# EasyEDA Pro project EasyedaPrj_POCKET_DICE_2026-03-14.epro, board PCB1
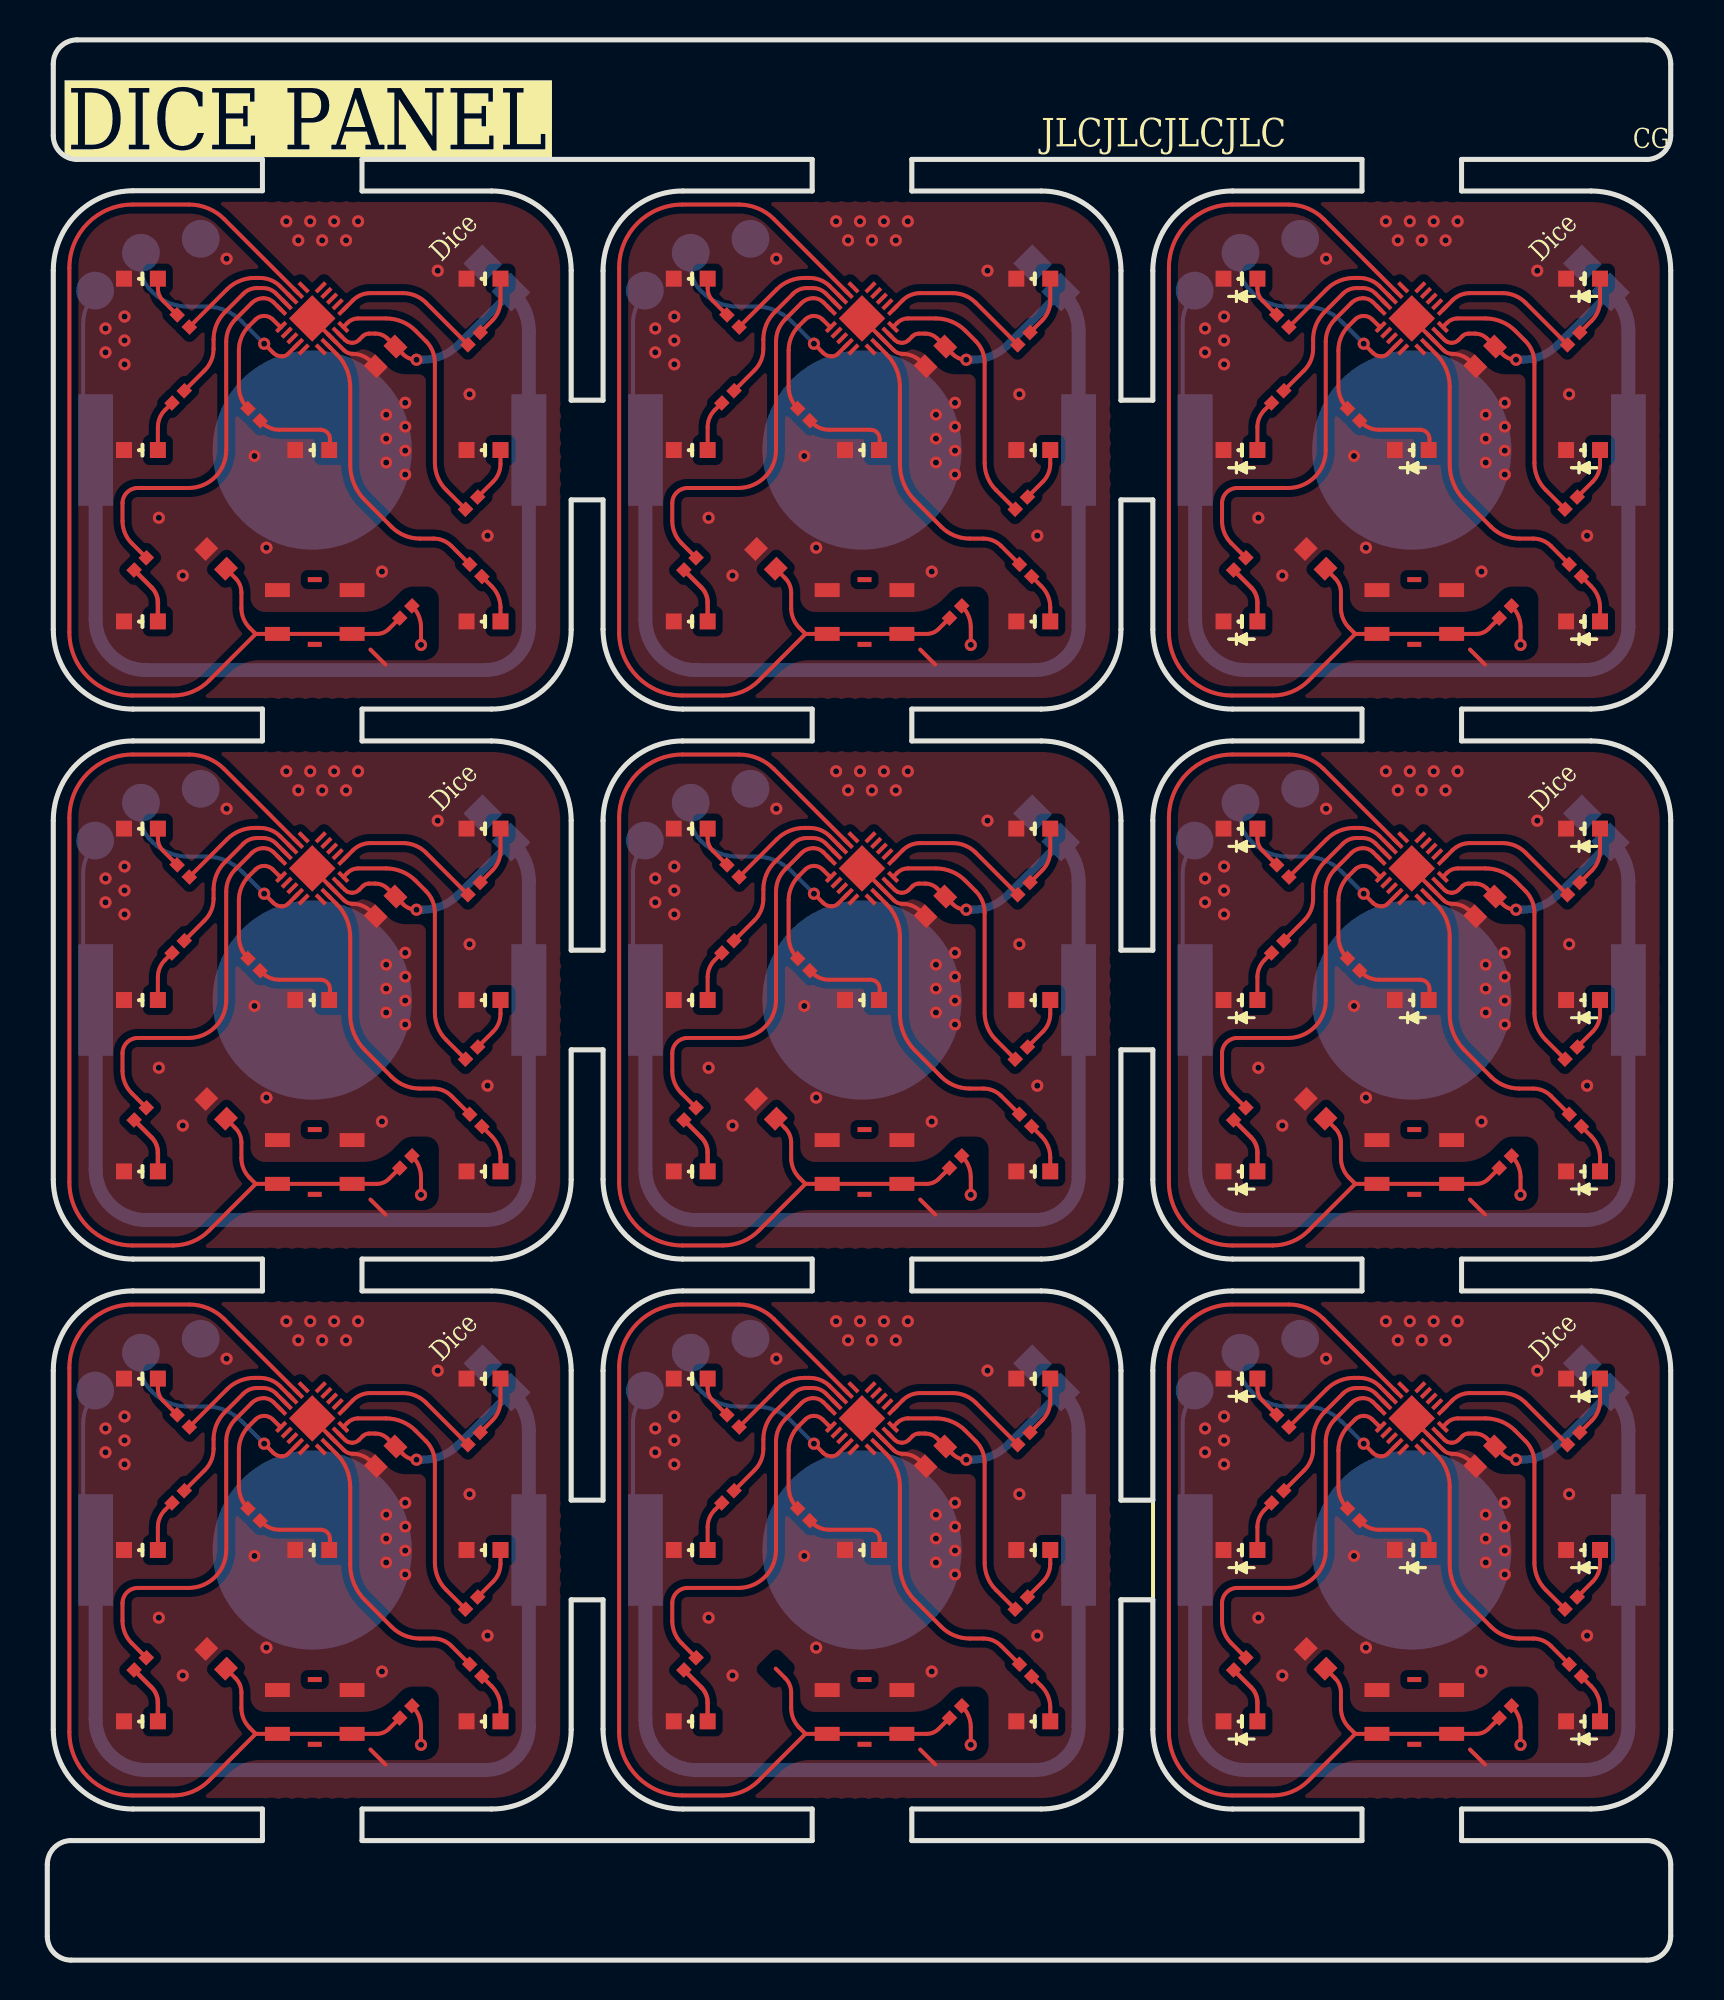
[diagram p1: board, top side]
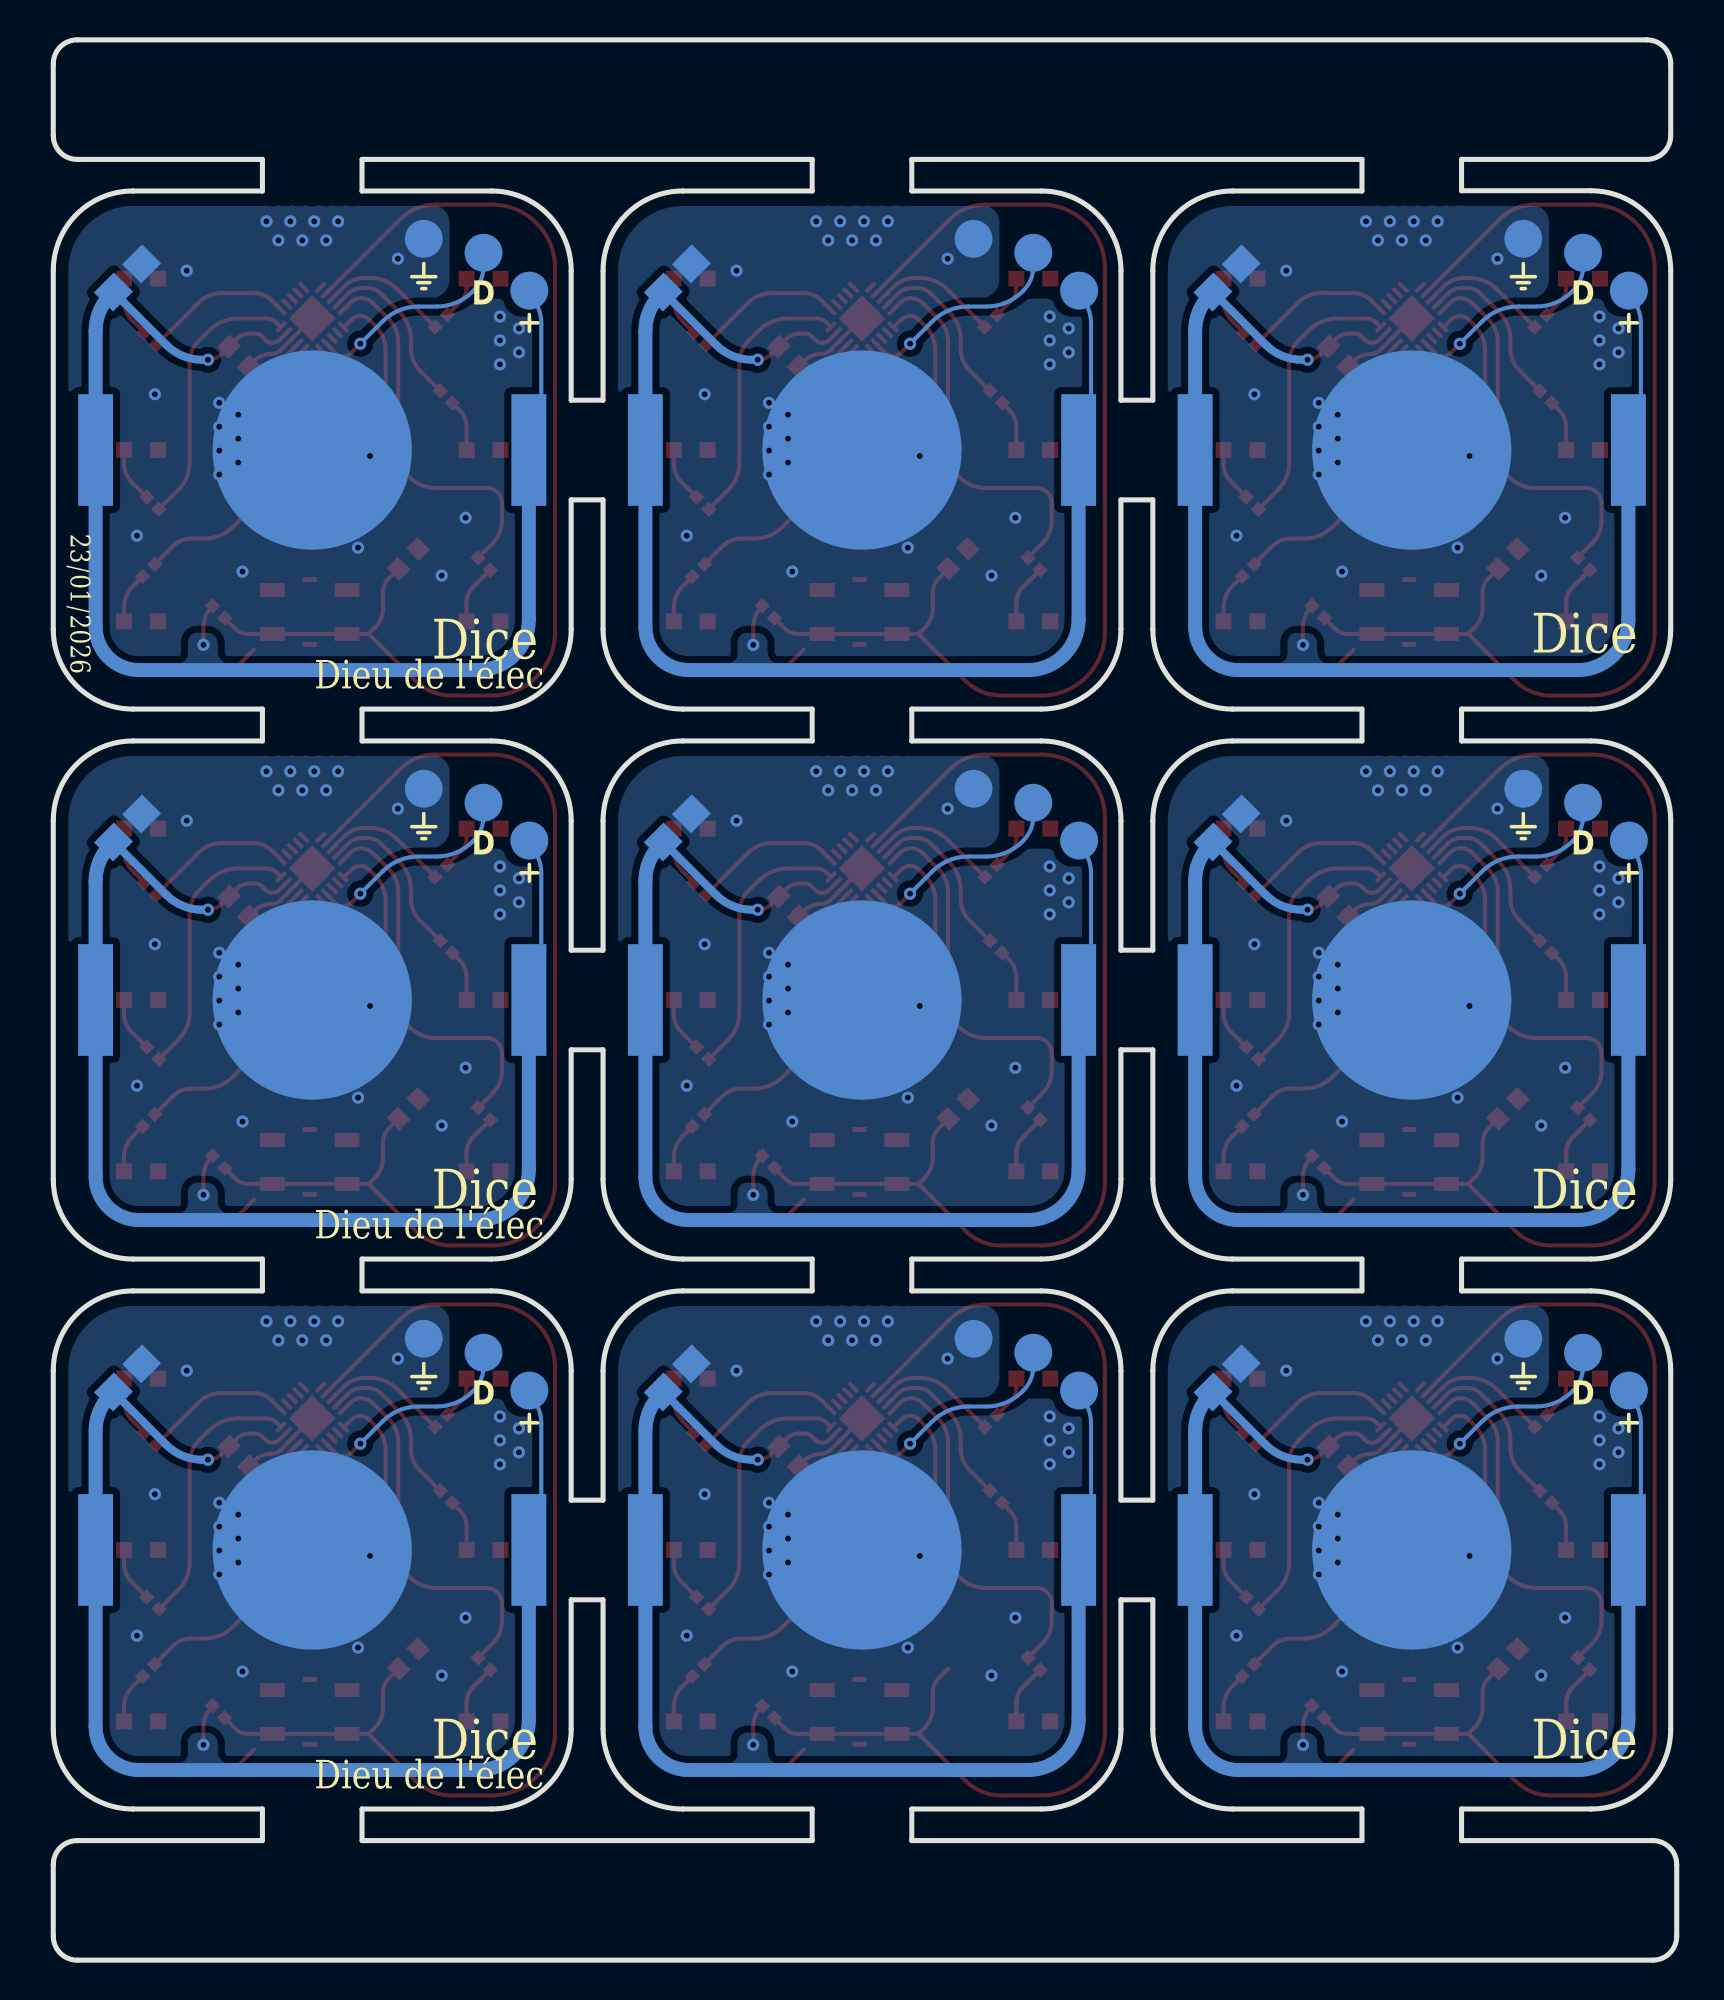
[diagram p2: board, bottom side, seen from below]

Outline 81.5 x 96.37 mm; copper layers: Top Layer, Bottom Layer. Coordinates in mm from the lower left corner of the outline.
Outline path: 0,4.8 0,1.2 arc(0.35,0.35) 1.2,0 80.3,0 arc(81.15,0.35) 81.5,1.2 81.5,4.8 arc(81.15,5.65) 80.3,6 71,6 71,7.58 77.5,7.58 arc(80.33,8.76) 81.5,11.58 81.5,29.58 arc(80.33,32.41) 77.5,33.58 71,33.58 71,35.18 77.5,35.18 arc(80.33,36.36) 81.5,39.18 81.5,57.18 arc(80.33,60.01) 77.5,61.18 71,61.18 71,62.78 77.5,62.78 arc(80.33,63.96) 81.5,66.78 81.5,84.78 arc(80.33,87.61) 77.5,88.78 71,88.78 71,90.37 80.3,90.37 arc(81.15,90.72) 81.5,91.57 81.5,95.17 arc(81.15,96.02) 80.3,96.37 1.5,96.37 arc(0.65,96.02) 0.3,95.17 0.3,91.57 arc(0.65,90.72) 1.5,90.37 10.8,90.37 10.8,88.8 4.31,88.8 arc(1.47,87.62) 0.3,84.78 0.3,66.78 arc(1.47,63.96) 4.3,62.78 10.8,62.78 10.8,61.2 arc(10.8,61.19) 10.79,61.18 4.3,61.18 arc(1.47,60.01) 0.3,57.18 0.3,39.18 arc(1.47,36.36) 4.3,35.18 10.8,35.18 10.8,33.58 4.3,33.58 arc(1.47,32.41) 0.3,29.58 0.3,11.58 arc(1.47,8.76) 4.3,7.58 10.8,7.58 10.8,6 1.2,6 arc(0.35,5.65) 0,4.8 ; 15.8,90.37 38.4,90.37 38.4,88.78 31.9,88.78 arc(29.07,87.61) 27.9,84.78 27.9,78.28 26.3,78.28 26.3,84.78 arc(25.13,87.61) 22.3,88.78 15.8,88.78 15.8,90.37 ; 15.8,62.78 15.8,61.18 22.3,61.18 arc(25.13,60.01) 26.3,57.18 26.3,50.68 27.9,50.68 27.9,57.18 arc(29.07,60.01) 31.9,61.18 38.4,61.18 38.4,62.78 31.9,62.78 arc(29.07,63.96) 27.9,66.78 27.9,73.28 26.3,73.28 26.3,66.78 arc(25.13,63.96) 22.3,62.78 15.8,62.78 ; 15.8,35.18 15.8,33.58 22.3,33.58 arc(25.13,32.41) 26.3,29.58 26.3,23.08 27.9,23.08 27.9,29.58 arc(29.07,32.41) 31.9,33.58 38.4,33.58 38.4,35.18 31.9,35.18 arc(29.07,36.36) 27.9,39.18 27.9,45.68 26.3,45.68 26.3,39.18 arc(25.13,36.36) 22.3,35.18 15.8,35.18 ; 15.8,7.58 22.3,7.58 arc(25.13,8.76) 26.3,11.58 26.3,18.08 27.9,18.08 27.9,11.58 arc(29.07,8.76) 31.9,7.58 38.4,7.58 38.4,6 15.8,6 15.8,7.58 ; 43.4,90.37 66,90.37 66,88.78 59.5,88.78 arc(56.67,87.61) 55.5,84.78 55.5,78.28 53.9,78.28 53.9,84.78 arc(52.73,87.61) 49.9,88.78 43.4,88.78 43.4,90.37 ; 43.4,62.78 43.4,61.18 49.9,61.18 arc(52.73,60.01) 53.9,57.18 53.9,50.68 55.5,50.68 55.5,57.18 arc(56.67,60.01) 59.5,61.18 66,61.18 66,62.78 59.5,62.78 arc(56.67,63.96) 55.5,66.78 55.5,73.28 53.9,73.28 53.9,66.78 arc(52.73,63.96) 49.9,62.78 43.4,62.78 ; 43.4,35.18 43.4,33.58 49.9,33.58 arc(52.73,32.41) 53.9,29.58 53.9,23.08 55.5,23.08 55.5,29.58 arc(56.67,32.41) 59.5,33.58 66,33.58 66,35.18 59.5,35.18 arc(56.67,36.36) 55.5,39.18 55.5,45.68 53.9,45.68 53.9,39.18 arc(52.73,36.36) 49.9,35.18 43.4,35.18 ; 43.4,7.58 49.9,7.58 arc(52.73,8.76) 53.9,11.58 53.9,18.08 55.5,18.08 55.5,11.58 arc(56.67,8.76) 59.5,7.58 66,7.58 66,6 43.4,6 43.4,7.58
Stack: Top Layer 0.035mm / Dielectric1 1.51mm FR4 er 4.5 / Bottom Layer 0.035mm

## Design rules (mm)
template: Custom Config
spacing copperThickness1oz (default): track to track 0.102, other pairs 0.152 to 0.3
spacing copperThickness2oz: track to track 0.203, other pairs 0.152 to 0.3
track width copperThickness1oz (default): min 0.127, default 0.254, max 2.54
track width copperThickness2oz: min 0.203, default 0.254, max 2.54
differential pair differentialPair (default): width min 0.127, default 0.254, max 2.54; gap min 0.152, default 0.152
via viaSize (default): diameter min 0.5, default 0.61, max 10; hole min 0.3, default 0.305, max 6.3
net GND.A uses Dice back
pour e985 uses Dice

## Placement (name value [footprint] x y rotation side)
C1  100nF  [C0603]  16.98 80.48 225 top
C1#2  -  [C0603]  44.58 80.48 225 top
C1#3  -  [C0603]  72.18 80.48 225 top
C1#4  -  [C0603]  16.98 52.88 225 top
C1#5  -  [C0603]  44.58 52.88 225 top
C1#6  -  [C0603]  72.18 52.88 225 top
C1#7  -  [C0603]  16.98 25.28 225 top
C1#8  -  [C0603]  44.58 25.28 225 top
C1#9  -  [C0603]  72.18 25.28 225 top
C2  10µF  [C0805]  22.57 84.42 135 bottom
C2#2  -  [C0805]  50.17 84.42 135 bottom
C2#3  -  [C0805]  77.77 84.42 135 bottom
C2#4  -  [C0805]  22.57 56.82 135 bottom
C2#5  -  [C0805]  50.17 56.82 135 bottom
C2#6  -  [C0805]  77.77 56.82 135 bottom
C2#7  -  [C0805]  22.57 29.22 135 bottom
C2#8  -  [C0805]  50.17 29.22 135 bottom
C2#9  -  [C0805]  77.77 29.22 135 bottom
C3  100nF  [C0603]  36.07 70.32 135 top
C3#2  -  [C0603]  63.67 70.32 135 top
C3#3  -  [C0603]  8.47 42.72 135 top
C3#4  -  [C0603]  36.07 42.72 135 top
C3#5  -  [C0603]  63.67 42.72 135 top
C3#6  -  [C0603]  8.47 15.12 135 top
C3#7  -  [C0603]  63.67 15.12 135 top
C3#8  -  [C0603]  8.47 70.32 135 top
LED1  XL-1608UOC-06  [ESPIO 0603 LED clean]  77.1 67.18 0 top
LED1#2  -  [ESPIO 0603 LED clean]  77.1 39.58 0 top
LED1#3  -  [ESPIO 0603 LED clean]  77.1 11.98 0 top
LED2  XL-1608UOC-06  [ESPIO 0603 LED clean]  77.1 75.78 0 top
LED2#2  -  [ESPIO 0603 LED clean]  77.1 48.18 0 top
LED2#3  -  [ESPIO 0603 LED clean]  77.1 20.58 0 top
LED2#4  -  [Dice  0603 LED BLANK]  21.9 75.78 0 top
LED2#5  -  [Dice  0603 LED BLANK]  21.9 48.18 0 top
LED2#6  -  [Dice  0603 LED BLANK]  21.9 20.58 0 top
LED2#7  -  [Dice  0603 LED BLANK]  49.5 20.58 0 top
LED2#8  -  [Dice  0603 LED BLANK]  49.5 48.18 0 top
LED2#9  -  [Dice  0603 LED BLANK]  49.5 75.78 0 top
LED3  XL-1608UOC-06  [ESPIO 0603 LED clean]  77.1 84.38 0 top
LED3#2  -  [ESPIO 0603 LED clean]  77.1 56.78 0 top
LED3#3  -  [ESPIO 0603 LED clean]  77.1 29.18 0 top
LED3#4  -  [Dice  0603 LED BLANK]  21.9 84.38 0 top
LED3#5  -  [Dice  0603 LED BLANK]  21.9 56.78 0 top
LED3#6  -  [Dice  0603 LED BLANK]  21.9 29.18 0 top
LED3#7  -  [Dice  0603 LED BLANK]  49.5 29.18 0 top
LED3#8  -  [Dice  0603 LED BLANK]  49.5 56.78 0 top
LED3#9  -  [Dice  0603 LED BLANK]  49.5 84.38 0 top
LED4  XL-1608UOC-06  [ESPIO 0603 LED clean]  68.5 75.78 0 top
LED4#2  -  [ESPIO 0603 LED clean]  68.5 48.18 0 top
LED4#3  -  [ESPIO 0603 LED clean]  68.5 20.58 0 top
LED4#4  -  [Dice  0603 LED BLANK]  13.3 75.78 0 top
LED4#5  -  [Dice  0603 LED BLANK]  13.3 48.18 0 top
LED4#6  -  [Dice  0603 LED BLANK]  13.3 20.58 0 top
LED4#7  -  [Dice  0603 LED BLANK]  40.9 20.58 0 top
LED4#8  -  [Dice  0603 LED BLANK]  40.9 48.18 0 top
LED5  XL-1608UOC-06  [ESPIO 0603 LED clean]  59.9 84.38 0 top
LED5#2  -  [ESPIO 0603 LED clean]  59.9 56.78 0 top
LED5#3  -  [ESPIO 0603 LED clean]  59.9 29.18 0 top
LED5#4  -  [Dice  0603 LED BLANK]  4.7 84.38 0 top
LED5#5  -  [Dice  0603 LED BLANK]  4.7 56.78 0 top
LED5#6  -  [Dice  0603 LED BLANK]  4.7 29.18 0 top
LED5#7  -  [Dice  0603 LED BLANK]  32.3 29.18 0 top
LED5#8  -  [Dice  0603 LED BLANK]  32.3 56.78 0 top
LED5#9  -  [Dice  0603 LED BLANK]  32.3 84.38 0 top
LED6  XL-1608UOC-06  [ESPIO 0603 LED clean]  59.9 75.78 0 top
LED6#2  -  [ESPIO 0603 LED clean]  59.9 48.18 0 top
LED6#3  -  [ESPIO 0603 LED clean]  59.9 20.58 0 top
LED6#4  -  [Dice  0603 LED BLANK]  4.7 75.78 0 top
LED6#5  -  [Dice  0603 LED BLANK]  4.7 48.18 0 top
LED6#6  -  [Dice  0603 LED BLANK]  4.7 20.58 0 top
LED6#7  -  [Dice  0603 LED BLANK]  32.3 20.58 0 top
LED6#8  -  [Dice  0603 LED BLANK]  32.3 48.18 0 top
LED6#9  -  [Dice  0603 LED BLANK]  32.3 75.78 0 top
LED7  XL-1608UOC-06  [ESPIO 0603 LED clean]  59.9 67.18 0 top
LED7#2  -  [ESPIO 0603 LED clean]  59.9 39.58 0 top
LED7#3  -  [ESPIO 0603 LED clean]  59.9 11.98 0 top
LED7#4  -  [Dice  0603 LED BLANK]  4.7 67.18 0 top
LED7#5  -  [Dice  0603 LED BLANK]  4.7 39.58 0 top
LED7#6  -  [Dice  0603 LED BLANK]  4.7 11.98 0 top
LED7#7  -  [Dice  0603 LED BLANK]  32.3 11.98 0 top
LED7#8  -  [Dice  0603 LED BLANK]  32.3 39.58 0 top
LED7#9  -  [Dice  0603 LED BLANK]  32.3 67.18 0 top
LED7#10  -  [Dice  0603 LED BLANK]  49.5 11.98 0 top
LED7#11  -  [Dice  0603 LED BLANK]  49.5 39.58 0 top
LED7#12  -  [Dice  0603 LED BLANK]  49.5 67.18 0 top
LED7#13  -  [Dice  0603 LED BLANK]  21.9 67.18 0 top
LED7#14  -  [Dice  0603 LED BLANK]  21.9 39.58 0 top
LED7#15  -  [Dice  0603 LED BLANK]  21.9 11.98 0 top
LED7#16  -  [Dice  0603 LED BLANK]  40.9 75.78 0 top
NOREF  -  [Pad_e12926]  57.6 28.58 0 top
NOREF#2  -  [Pad_e11275]  59.9 85.68 0 top
NOREF#3  -  [Pad_e11000]  32.3 85.68 0 top
NOREF#4  -  [Pad_e11001]  30 83.78 0 top
NOREF#5  -  [Pad_e12375]  4.7 30.48 0 top
NOREF#6  -  [Pad_e11274]  62.9 86.38 0 top
NOREF#7  -  [Pad_e12099]  62.9 58.78 0 top
NOREF#8  -  [Pad_e11825]  32.3 58.08 0 top
NOREF#9  -  [Pad_e23]  4.7 85.68 0 top
NOREF#10  -  [Pad_e12101]  57.6 56.18 0 top
NOREF#11  -  [Pad_e24]  2.4 83.78 0 top
NOREF#12  -  [Pad_e11549]  7.7 58.78 0 top
NOREF#13  -  [Pad_e11550]  4.7 58.08 0 top
NOREF#14  -  [Pad_e12376]  2.4 28.58 0 top
NOREF#15  -  [Pad_e12651]  30 28.58 0 top
NOREF#16  -  [Pad_e12649]  35.3 31.18 0 top
NOREF#17  -  [Pad_e21]  7.7 86.38 0 top
NOREF#18  -  [Pad_e11824]  35.3 58.78 0 top
NOREF#19  -  [Pad_e12925]  59.9 30.48 0 top
NOREF#20  -  [Pad_e12100]  59.9 58.08 0 top
NOREF#21  -  [Pad_e12924]  62.9 31.18 0 top
NOREF#22  -  [Pad_e12374]  7.7 31.18 0 top
NOREF#23  -  [Pad_e11551]  2.4 56.18 0 top
NOREF#24  -  [Pad_e11276]  57.6 83.78 0 top
NOREF#25  -  [Pad_e12650]  32.3 30.48 0 top
NOREF#26  -  [Pad_e10999]  35.3 86.38 0 top
NOREF#27  -  [Pad_e11826]  30 56.18 0 top
R1  1K  [R0402]  21.51 69.74 135 top
R1#2  -  [R0402]  49.11 69.74 135 top
R1#3  -  [R0402]  76.71 69.74 135 top
R1#4  -  [R0402]  21.51 42.14 135 top
R1#5  -  [R0402]  49.11 42.14 135 top
R1#6  -  [R0402]  76.71 42.14 135 top
R1#7  -  [R0402]  21.51 14.54 135 top
R1#8  -  [R0402]  49.11 14.54 135 top
R1#9  -  [R0402]  76.71 14.54 135 top
R2  1K  [R0402]  48.9 73.12 225 top
R2#2  -  [R0402]  21.3 73.12 225 top
R2#3  -  [R0402]  76.5 73.12 225 top
R2#4  -  [R0402]  21.3 45.52 225 top
R2#5  -  [R0402]  48.9 45.52 225 top
R2#6  -  [R0402]  76.5 45.52 225 top
R2#7  -  [R0402]  21.3 17.92 225 top
R2#8  -  [R0402]  48.9 17.92 225 top
R2#9  -  [R0402]  76.5 17.92 225 top
R3  1K  [R0402]  49.03 81.37 225 top
R3#2  -  [R0402]  76.63 81.37 225 top
R3#3  -  [R0402]  21.43 53.77 225 top
R3#4  -  [R0402]  49.03 53.77 225 top
R3#5  -  [R0402]  21.43 81.37 225 top
R3#6  -  [R0402]  76.63 53.77 225 top
R3#7  -  [R0402]  21.43 26.17 225 top
R3#8  -  [R0402]  49.03 26.17 225 top
R3#9  -  [R0402]  76.63 26.17 225 top
R4  1K  [R0402]  37.98 77.56 135 top
R4#2  -  [R0402]  65.58 77.56 135 top
R4#3  -  [R0402]  10.38 49.96 135 top
R4#4  -  [R0402]  37.98 49.96 135 top
R4#5  -  [R0402]  65.58 49.96 135 top
R4#6  -  [R0402]  10.38 22.36 135 top
R4#7  -  [R0402]  37.98 22.36 135 top
R4#8  -  [R0402]  65.58 22.36 135 top
R4#9  -  [R0402]  10.38 77.56 135 top
R5  1K  [R0402]  34.42 82.26 315 top
R5#2  -  [R0402]  62.02 82.26 315 top
R5#3  -  [R0402]  6.82 54.66 315 top
R5#4  -  [R0402]  34.42 54.66 315 top
R5#5  -  [R0402]  62.02 54.66 315 top
R5#6  -  [R0402]  6.82 27.06 315 top
R5#7  -  [R0402]  34.42 27.06 315 top
R5#8  -  [R0402]  62.02 27.06 315 top
R5#9  -  [R0402]  6.82 82.26 315 top
R6  1K  [R0402]  34.17 78.45 45 top
R6#2  -  [R0402]  61.77 78.45 45 top
R6#3  -  [R0402]  6.57 50.85 45 top
R6#4  -  [R0402]  34.17 50.85 45 top
R6#5  -  [R0402]  61.77 50.85 45 top
R6#6  -  [R0402]  6.57 23.25 45 top
R6#7  -  [R0402]  34.17 23.25 45 top
R6#8  -  [R0402]  61.77 23.25 45 top
R6#9  -  [R0402]  6.57 78.45 45 top
R7  1K  [R0402]  32.26 70.07 45 top
R7#2  -  [R0402]  59.86 70.07 45 top
R7#3  -  [R0402]  4.66 42.47 45 top
R7#4  -  [R0402]  32.26 42.47 45 top
R7#5  -  [R0402]  59.86 42.47 45 top
R7#6  -  [R0402]  4.66 14.87 45 top
R7#7  -  [R0402]  32.26 14.87 45 top
R7#8  -  [R0402]  59.86 14.87 45 top
R7#9  -  [R0402]  4.66 70.07 45 top
R8  200K  [R0402]  45.6 67.66 225 top
R8#2  -  [R0402]  73.2 67.66 225 top
R8#3  -  [R0402]  18 40.06 225 top
R8#4  -  [R0402]  45.6 40.06 225 top
R8#5  -  [R0402]  73.2 40.06 225 top
R8#6  -  [R0402]  18 12.46 225 top
R8#7  -  [R0402]  45.6 12.46 225 top
R8#8  -  [R0402]  73.2 12.46 225 top
R8#9  -  [R0402]  18 67.66 225 top
SW1  TS-1075S-A1B2-D4  [SW-SMD_4P-L3.1-W3.1-P2.20-LS4.0]  68.63 12.46 0 top
SW1#2  -  [SW-SMD_4P-L3.1-W3.1-P2.20-LS4.0]  41.03 67.66 0 top
SW1#3  -  [SW-SMD_4P-L3.1-W3.1-P2.20-LS4.0]  68.63 67.66 0 top
SW1#4  -  [SW-SMD_4P-L3.1-W3.1-P2.20-LS4.0]  13.43 40.06 0 top
SW1#5  -  [SW-SMD_4P-L3.1-W3.1-P2.20-LS4.0]  41.03 40.06 0 top
SW1#6  -  [SW-SMD_4P-L3.1-W3.1-P2.20-LS4.0]  68.63 40.06 0 top
SW1#7  -  [SW-SMD_4P-L3.1-W3.1-P2.20-LS4.0]  13.43 12.46 0 top
SW1#8  -  [SW-SMD_4P-L3.1-W3.1-P2.20-LS4.0]  41.03 12.46 0 top
SW1#9  -  [SW-SMD_4P-L3.1-W3.1-P2.20-LS4.0]  13.43 67.66 0 top
U1  ATTINY1616-MNR  [QFN-20_L3.0-W3.0-P0.40-BL-EP1.7]  40.9 82.39 45 top
U1#2  -  [QFN-20_L3.0-W3.0-P0.40-BL-EP1.7]  68.5 82.39 45 top
U1#3  -  [QFN-20_L3.0-W3.0-P0.40-BL-EP1.7]  13.3 54.79 45 top
U1#4  -  [QFN-20_L3.0-W3.0-P0.40-BL-EP1.7]  40.9 54.79 45 top
U1#5  -  [QFN-20_L3.0-W3.0-P0.40-BL-EP1.7]  68.5 54.79 45 top
U1#6  -  [QFN-20_L3.0-W3.0-P0.40-BL-EP1.7]  13.3 27.19 45 top
U1#7  -  [QFN-20_L3.0-W3.0-P0.40-BL-EP1.7]  40.9 27.19 45 top
U1#8  -  [QFN-20_L3.0-W3.0-P0.40-BL-EP1.7]  68.5 27.19 45 top
U1#9  -  [QFN-20_L3.0-W3.0-P0.40-BL-EP1.7]  13.3 82.39 45 top
U7  MY-2016-02  [BAT-SMD_MY-2032-08]  40.9 75.78 180 bottom
U7#2  -  [BAT-SMD_MY-2032-08]  68.5 75.78 180 bottom
U7#3  -  [BAT-SMD_MY-2032-08]  13.3 48.18 180 bottom
U7#4  -  [BAT-SMD_MY-2032-08]  40.9 48.18 180 bottom
U7#5  -  [BAT-SMD_MY-2032-08]  68.5 48.18 180 bottom
U7#6  -  [BAT-SMD_MY-2032-08]  13.3 20.58 180 bottom
U7#7  -  [BAT-SMD_MY-2032-08]  40.9 20.58 180 bottom
U7#8  -  [BAT-SMD_MY-2032-08]  68.5 20.58 180 bottom
U7#9  -  [BAT-SMD_MY-2032-08]  13.3 75.78 180 bottom

## Footprints (pads in the part's own frame, mm; a bottom-side part is the same pattern mirrored in y, then rotated)
BAT-SMD_MY-2032-08
  rect 1.75x5.6 smd: 1(-10.875,0) 1(10.875,0)
  round 10 smd: 2(0,0)
C0603
  rect 0.8x0.9 smd: 1(-0.7,0) 2(0.7,0)
C0805
  rect 1.41x1.35 smd: 1(-1,0) 2(1,0)
Dice  0603 LED BLANK
  rect 0.8x0.8 smd: 1(0.851,0) 2(-0.851,0)
ESPIO 0603 LED clean
  rect 0.8x0.8 smd: 1(0.851,0) 2(-0.851,0)
Pad_e21
  rrect 1.9x1.9 smd far side: 1(0,0)
Pad_e23
  rrect 1.9x1.9 smd far side: 1(0,0)
Pad_e24
  rrect 1.9x1.9 smd far side: 1(0,0)
Pad_e10999
  rrect 1.9x1.9 smd far side: 22(0,0)
Pad_e11000
  rrect 1.9x1.9 smd far side: 23(0,0)
Pad_e11001
  rrect 1.9x1.9 smd far side: 24(0,0)
Pad_e11274
  rrect 1.9x1.9 smd far side: 25(0,0)
Pad_e11275
  rrect 1.9x1.9 smd far side: 26(0,0)
Pad_e11276
  rrect 1.9x1.9 smd far side: 27(0,0)
Pad_e11549
  rrect 1.9x1.9 smd far side: 28(0,0)
Pad_e11550
  rrect 1.9x1.9 smd far side: 29(0,0)
Pad_e11551
  rrect 1.9x1.9 smd far side: 30(0,0)
Pad_e11824
  rrect 1.9x1.9 smd far side: 31(0,0)
Pad_e11825
  rrect 1.9x1.9 smd far side: 32(0,0)
Pad_e11826
  rrect 1.9x1.9 smd far side: 33(0,0)
Pad_e12099
  rrect 1.9x1.9 smd far side: 34(0,0)
Pad_e12100
  rrect 1.9x1.9 smd far side: 35(0,0)
Pad_e12101
  rrect 1.9x1.9 smd far side: 36(0,0)
Pad_e12374
  rrect 1.9x1.9 smd far side: 37(0,0)
Pad_e12375
  rrect 1.9x1.9 smd far side: 38(0,0)
Pad_e12376
  rrect 1.9x1.9 smd far side: 39(0,0)
Pad_e12649
  rrect 1.9x1.9 smd far side: 40(0,0)
Pad_e12650
  rrect 1.9x1.9 smd far side: 41(0,0)
Pad_e12651
  rrect 1.9x1.9 smd far side: 42(0,0)
Pad_e12924
  rrect 1.9x1.9 smd far side: 43(0,0)
Pad_e12925
  rrect 1.9x1.9 smd far side: 44(0,0)
Pad_e12926
  rrect 1.9x1.9 smd far side: 45(0,0)
QFN-20_L3.0-W3.0-P0.40-BL-EP1.7
  rect 0.2x0.665 smd: 1(-0.8,-1.407) 2(-0.4,-1.407) 3(0,-1.407) 4(0.4,-1.407) 5(0.8,-1.407) 11(0.8,1.407) 12(0.4,1.407) 13(0,1.407) 14(-0.4,1.407) 15(-0.8,1.407)
  rect 0.665x0.2 smd: 6(1.407,-0.8) 7(1.407,-0.4) 8(1.407,0) 9(1.407,0.4) 10(1.407,0.8) 16(-1.407,0.8) 17(-1.407,0.4) 18(-1.407,0) 19(-1.407,-0.4) 20(-1.407,-0.8)
  rect 1.65x1.65 smd: 21(0,0)
R0402
  rect 0.566x0.54 smd: 1(-0.433,0) 2(0.433,0)
SW-SMD_4P-L3.1-W3.1-P2.20-LS4.0
  rect 1.25x0.7 smd: 1(-1.875,1.1) 2(1.875,1.1) 3(-1.875,-1.1) 4(1.875,-1.1)
  rect 0.7x0.25 smd: 5(0,-1.625) 6(0,1.625)

## Nets
GND.A: C1.2 C1#2.2 C1#3.2 C1#4.2 C1#5.2 C1#6.2 C1#7.2 C1#8.2 C1#9.2 C2.2 C2#2.2 C2#3.2 C2#4.2 C2#5.2 C2#6.2 C2#7.2 C2#8.2 C2#9.2 C3.2 C3#2.2 C3#3.2 C3#4.2 C3#5.2 C3#6.2 C3#7.2 C3#8.2 LED1.2 LED1#2.2 LED1#3.2 LED2.2 LED2#2.2 LED2#3.2 LED2#4.2 LED2#5.2 LED2#6.2 LED2#7.2 LED2#8.2 LED2#9.2 LED3.2 LED3#2.2 LED3#3.2 LED3#4.2 LED3#5.2 LED3#6.2 LED3#7.2 LED3#8.2 LED3#9.2 LED4.2 LED4#2.2 LED4#3.2 LED4#4.2 LED4#5.2 LED4#6.2 LED4#7.2 LED4#8.2 LED5.2 LED5#2.2 LED5#3.2 LED5#4.2 LED5#5.2 LED5#6.2 LED5#7.2 LED5#8.2 LED5#9.2 LED6.2 LED6#2.2 LED6#3.2 LED6#4.2 LED6#5.2 LED6#6.2 LED6#7.2 LED6#8.2 LED6#9.2 LED7.2 LED7#2.2 LED7#3.2 LED7#4.2 LED7#5.2 LED7#6.2 LED7#7.2 LED7#8.2 LED7#9.2 LED7#10.2 LED7#11.2 LED7#12.2 LED7#13.2 LED7#14.2 LED7#15.2 LED7#16.2 NOREF#6.25 NOREF#7.34 NOREF#12.28 NOREF#16.40 NOREF#17.1 NOREF#18.31 NOREF#21.43 NOREF#22.37 NOREF#26.22 SW1.1 SW1.2 SW1#2.1 SW1#2.2 SW1#3.1 SW1#3.2 SW1#4.1 SW1#4.2 SW1#5.1 SW1#5.2 SW1#6.1 SW1#6.2 SW1#7.1 SW1#7.2 SW1#8.1 SW1#8.2 SW1#9.1 SW1#9.2 U1.3 U1.21 U1#2.3 U1#2.21 U1#3.3 U1#3.21 U1#4.3 U1#4.21 U1#5.3 U1#5.21 U1#6.3 U1#6.21 U1#7.3 U1#7.21 U1#8.3 U1#8.21 U1#9.3 U1#9.21 U7.2 U7#2.2 U7#3.2 U7#4.2 U7#5.2 U7#6.2 U7#7.2 U7#8.2 U7#9.2
VDD.A: C1.1 C1#2.1 C1#3.1 C1#4.1 C1#5.1 C1#6.1 C1#7.1 C1#8.1 C1#9.1 C2.1 C2#2.1 C2#3.1 C2#4.1 C2#5.1 C2#6.1 C2#7.1 C2#8.1 C2#9.1 NOREF.45 NOREF#4.24 NOREF#10.36 NOREF#11.1 NOREF#14.39 NOREF#15.42 NOREF#23.30 NOREF#24.27 NOREF#27.33 R8.1 R8#2.1 R8#3.1 R8#4.1 R8#5.1 R8#6.1 R8#7.1 R8#8.1 R8#9.1 U1.4 U1#2.4 U1#3.4 U1#4.4 U1#5.4 U1#6.4 U1#7.4 U1#8.4 U1#9.4 U7.1 U7#2.1 U7#3.1 U7#4.1 U7#5.1 U7#6.1 U7#7.1 U7#8.1 U7#9.1
BUTTON.A: C3.1 C3#2.1 C3#3.1 C3#4.1 C3#5.1 C3#6.1 C3#7.1 C3#8.1 R8.2 R8#2.2 R8#3.2 R8#4.2 R8#5.2 R8#6.2 R8#7.2 R8#8.2 R8#9.2 SW1.3 SW1.4 SW1#2.3 SW1#2.4 SW1#3.3 SW1#3.4 SW1#4.3 SW1#4.4 SW1#5.3 SW1#5.4 SW1#6.3 SW1#6.4 SW1#7.3 SW1#7.4 SW1#8.3 SW1#8.4 SW1#9.3 SW1#9.4 U1.12 U1#2.12 U1#3.12 U1#4.12 U1#5.12 U1#6.12 U1#7.12 U1#8.12 U1#9.12
LED1: R1.2 R1#2.2 R1#3.2 R1#4.2 R1#5.2 R1#6.2 R1#7.2 R1#8.2 R1#9.2 U1.2 U1#2.2 U1#3.2 U1#4.2 U1#5.2 U1#6.2 U1#7.2 U1#8.2 U1#9.2
LED2: R2.2 R2#2.2 R2#3.2 R2#4.2 R2#5.2 R2#6.2 R2#7.2 R2#8.2 R2#9.2 U1.5 U1#2.5 U1#3.5 U1#4.5 U1#5.5 U1#6.5 U1#7.5 U1#8.5 U1#9.5
LED3: R3.2 R3#2.2 R3#3.2 R3#4.2 R3#5.2 R3#6.2 R3#7.2 R3#8.2 R3#9.2 U1.6 U1#2.6 U1#3.6 U1#4.6 U1#5.6 U1#6.6 U1#7.6 U1#8.6 U1#9.6
LED4: R4.2 R4#2.2 R4#3.2 R4#4.2 R4#5.2 R4#6.2 R4#7.2 R4#8.2 R4#9.2 U1.16 U1#2.16 U1#3.16 U1#4.16 U1#5.16 U1#6.16 U1#7.16 U1#8.16 U1#9.16
LED5: R5.2 R5#2.2 R5#3.2 R5#4.2 R5#5.2 R5#6.2 R5#7.2 R5#8.2 R5#9.2 U1.13 U1#2.13 U1#3.13 U1#4.13 U1#5.13 U1#6.13 U1#7.13 U1#8.13 U1#9.13
LED6: R6.2 R6#2.2 R6#3.2 R6#4.2 R6#5.2 R6#6.2 R6#7.2 R6#8.2 R6#9.2 U1.14 U1#2.14 U1#3.14 U1#4.14 U1#5.14 U1#6.14 U1#7.14 U1#8.14 U1#9.14
LED7: R7.2 R7#2.2 R7#3.2 R7#4.2 R7#5.2 R7#6.2 R7#7.2 R7#8.2 R7#9.2 U1.15 U1#2.15 U1#3.15 U1#4.15 U1#5.15 U1#6.15 U1#7.15 U1#8.15 U1#9.15
UPDI.A: NOREF#2.26 NOREF#3.23 NOREF#5.38 NOREF#8.32 NOREF#9.1 NOREF#13.29 NOREF#19.44 NOREF#20.35 NOREF#25.41 U1.19 U1#2.19 U1#3.19 U1#4.19 U1#5.19 U1#6.19 U1#7.19 U1#8.19 U1#9.19
$1N725: LED1.1 LED1#2.1 LED1#3.1 LED7#10.1 LED7#11.1 LED7#12.1 LED7#13.1 LED7#14.1 LED7#15.1 R1.1 R1#2.1 R1#3.1 R1#4.1 R1#5.1 R1#6.1 R1#7.1 R1#8.1 R1#9.1
$1N793: LED2.1 LED2#2.1 LED2#3.1 LED2#4.1 LED2#5.1 LED2#6.1 LED2#7.1 LED2#8.1 LED2#9.1 R2.1 R2#2.1 R2#3.1 R2#4.1 R2#5.1 R2#6.1 R2#7.1 R2#8.1 R2#9.1
$1N861: LED3.1 LED3#2.1 LED3#3.1 LED3#4.1 LED3#5.1 LED3#6.1 LED3#7.1 LED3#8.1 LED3#9.1 R3.1 R3#2.1 R3#3.1 R3#4.1 R3#5.1 R3#6.1 R3#7.1 R3#8.1 R3#9.1
$1N929: LED4.1 LED4#2.1 LED4#3.1 LED4#4.1 LED4#5.1 LED4#6.1 LED4#7.1 LED4#8.1 LED7#16.1 R4.1 R4#2.1 R4#3.1 R4#4.1 R4#5.1 R4#6.1 R4#7.1 R4#8.1 R4#9.1
$1N1129: LED7.1 LED7#2.1 LED7#3.1 LED7#4.1 LED7#5.1 LED7#6.1 LED7#7.1 LED7#8.1 LED7#9.1 R7.1 R7#2.1 R7#3.1 R7#4.1 R7#5.1 R7#6.1 R7#7.1 R7#8.1 R7#9.1
$1N1131: LED6.1 LED6#2.1 LED6#3.1 LED6#4.1 LED6#5.1 LED6#6.1 LED6#7.1 LED6#8.1 LED6#9.1 R6.1 R6#2.1 R6#3.1 R6#4.1 R6#5.1 R6#6.1 R6#7.1 R6#8.1 R6#9.1
$1N1133: LED5.1 LED5#2.1 LED5#3.1 LED5#4.1 LED5#5.1 LED5#6.1 LED5#7.1 LED5#8.1 LED5#9.1 R5.1 R5#2.1 R5#3.1 R5#4.1 R5#5.1 R5#6.1 R5#7.1 R5#8.1 R5#9.1

Pads without a net: SW1 5 6; SW1#2 5 6; SW1#3 5 6; SW1#4 5 6; SW1#5 5 6; SW1#6 5 6; SW1#7 5 6; SW1#8 5 6; SW1#9 5 6; U1 1 7 8 9 10 11 17 18 20; U1#2 1 7 8 9 10 11 17 18 20; U1#3 1 7 8 9 10 11 17 18 20; U1#4 1 7 8 9 10 11 17 18 20; U1#5 1 7 8 9 10 11 17 18 20; U1#6 1 7 8 9 10 11 17 18 20; U1#7 1 7 8 9 10 11 17 18 20; U1#8 1 7 8 9 10 11 17 18 20; U1#9 1 7 8 9 10 11 17 18 20

## Via types
v1: diameter 0.61, hole 0.305, Top Layer to Bottom Layer, 279 vias

## Routing (per net, layer and track width the routed paths; a pad name or vN(x,y) marks a point on that pad's centre or on a via; arc(x,y) is an arc through that point)
GND.A: length 46.5
  Top Layer w0.2: 16.98,9.81 16.22,10.57 ; U1#8.21 U1#8.3 70.1,25.59 arc(70.3,25.46) 70.53,25.41 arc(71.03,25.31) 71.44,25.03 C1#9.2 ; 72.18,9.81 71.42,10.57 ; U1#5.21 U1#5.3 70.1,53.19 arc(70.3,53.06) 70.53,53.01 arc(71.03,52.91) 71.44,52.63 C1#6.2 ; 44.58,9.81 43.82,10.57 ; 16.98,37.41 16.22,38.17 ; U1#3.21 U1#3.3 14.9,53.19 arc(15.1,53.06) 15.33,53.01 arc(15.83,52.91) 16.24,52.63 C1#4.2 ; U1#6.21 U1#6.3 14.9,25.59 arc(15.1,25.46) 15.33,25.41 arc(15.83,25.31) 16.24,25.03 C1#7.2 ; C1#5.2 43.84,52.63 arc(43.43,52.91) 42.93,53.01 arc(42.7,53.06) 42.5,53.19 U1#4.3 U1#4.21 ; U1#7.21 U1#7.3 42.5,25.59 arc(42.7,25.46) 42.93,25.41 arc(43.43,25.31) 43.84,25.03 C1#8.2 ; U1#9.21 U1#9.3 14.9,80.79 arc(15.1,80.66) 15.33,80.61 arc(15.83,80.51) 16.24,80.23 C1.2 ; 72.18,65.01 71.42,65.77 ; U1.21 U1.3 42.5,80.79 arc(42.7,80.66) 42.93,80.61 arc(43.43,80.51) 43.84,80.23 C1#2.2 ; 44.58,65.01 43.82,65.77 ; C1#3.2 71.44,80.23 arc(71.03,80.51) 70.53,80.61 arc(70.3,80.66) 70.1,80.79 U1#2.3 U1#2.21 ; 44.58,37.41 43.82,38.17 ; 72.18,37.41 71.42,38.17 ; 16.98,65.01 16.22,65.77
  vias: v1(2.92,81.89) v1(2.92,80.69) v1(2.92,54.29) v1(2.92,53.09) v1(2.92,26.69) v1(2.92,25.49) v1(3.88,82.48) v1(3.88,81.28) v1(3.88,80.08) v1(3.88,54.88) v1(3.88,53.68) v1(3.88,52.48) v1(3.88,27.28) v1(3.88,26.08) v1(3.88,24.88) v1(5.6,72.38) v1(5.6,44.78) v1(5.6,17.18) v1(6.8,69.48) v1(6.8,41.88) v1(6.8,14.28) v1(9,85.38) v1(9,57.78) v1(9,30.18) v1(10.4,75.48) v1(10.4,47.88) v1(10.4,20.28) v1(11,70.88) v1(11,43.28) v1(11,15.68) v1(12,87.26) v1(12,59.66) v1(12,32.06) v1(12.6,86.31) v1(12.6,58.71) v1(12.6,31.11) v1(13.2,87.26) v1(13.2,59.66) v1(13.2,32.06) v1(13.8,86.31) v1(13.8,58.71) v1(13.8,31.11) v1(14.4,87.26) v1(14.4,59.66) v1(14.4,32.06) v1(15,86.31) v1(15,58.71) v1(15,31.11) v1(15.6,87.26) v1(15.6,59.66) v1(15.6,32.06) v1(16.8,69.68) v1(16.8,42.08) v1(16.8,14.48) v1(17.01,77.56) v1(17.01,76.36) v1(17.01,75.16) v1(17.01,49.96) v1(17.01,48.76) v1(17.01,47.56) v1(17.01,22.36) v1(17.01,21.16) v1(17.01,19.96) v1(17.97,78.16) v1(17.97,76.96) v1(17.97,75.76) v1(17.97,74.56) v1(17.97,50.56) v1(17.97,49.36) v1(17.97,48.16) v1(17.97,46.96) v1(17.97,22.96) v1(17.97,21.75) v1(17.97,20.56) v1(17.97,19.36) v1(19.6,84.78) v1(19.6,57.18) v1(19.6,29.58) v1(21.2,78.58) v1(21.2,50.98) v1(21.2,23.38) v1(22.1,71.48) v1(22.1,43.88) v1(22.1,16.28) v1(30.52,81.89) v1(30.52,80.69) v1(30.52,54.29) v1(30.52,53.09) v1(30.52,26.69) v1(30.52,25.49) v1(31.48,82.48) v1(31.48,81.28) v1(31.48,80.08) v1(31.48,54.88) v1(31.48,53.68) v1(31.48,52.48) v1(31.48,27.28) v1(31.48,26.08) v1(31.48,24.88) v1(33.2,72.38) v1(33.2,44.78) v1(33.2,17.18) v1(34.4,69.48) v1(34.4,41.88) v1(34.4,14.28) v1(36.6,85.38) v1(36.6,57.78) v1(36.6,30.18) v1(38,75.48) v1(38,47.88) v1(38,20.28) v1(38.6,70.88) v1(38.6,43.28) v1(38.6,15.68) v1(39.6,87.26) v1(39.6,59.66) v1(39.6,32.06) v1(40.2,86.31) v1(40.2,58.71) v1(40.2,31.11) v1(40.8,87.26) v1(40.8,59.66) v1(40.8,32.06) v1(41.4,86.31) v1(41.4,58.71) v1(41.4,31.11) v1(42,87.26) v1(42,59.66) v1(42,32.06) v1(42.6,86.31) v1(42.6,58.71) v1(42.6,31.11) v1(43.2,87.26) v1(43.2,59.66) v1(43.2,32.06) v1(44.4,69.68) v1(44.4,42.08) v1(44.4,14.48) v1(44.61,77.56) v1(44.61,76.36) v1(44.61,75.16) v1(44.61,49.96) v1(44.61,48.76) v1(44.61,47.56) v1(44.61,22.36) v1(44.61,21.16) v1(44.61,19.96) v1(45.57,78.16) v1(45.57,76.96) v1(45.57,75.76) v1(45.57,74.56) v1(45.57,50.56) v1(45.57,49.36) v1(45.57,48.16) v1(45.57,46.96) v1(45.57,22.96) v1(45.57,21.75) v1(45.57,20.56) v1(45.57,19.36) v1(47.2,84.78) v1(47.2,57.18) v1(47.2,29.58) v1(48.8,78.58) v1(48.8,50.98) v1(48.8,23.38) v1(49.7,71.48) v1(49.7,43.88) v1(49.7,16.28) v1(58.12,81.89) v1(58.12,80.69) v1(58.12,54.29) v1(58.12,53.09) v1(58.12,26.69) v1(58.12,25.49) v1(59.08,82.48) v1(59.08,81.28) v1(59.08,80.08) v1(59.08,54.88) v1(59.08,53.68) v1(59.08,52.48) v1(59.08,27.28) v1(59.08,26.08) v1(59.08,24.88) v1(60.8,72.38) v1(60.8,44.78) v1(60.8,17.18) v1(62,69.48) v1(62,41.88) v1(62,14.28) v1(64.2,85.38) v1(64.2,57.78) v1(64.2,30.18) v1(65.6,75.48) v1(65.6,47.88) v1(65.6,20.28) v1(66.2,70.88) v1(66.2,43.28) v1(66.2,15.68) v1(67.2,87.26) v1(67.2,59.66) v1(67.2,32.06) v1(67.8,86.31) v1(67.8,58.71) v1(67.8,31.11) v1(68.4,87.26) v1(68.4,59.66) v1(68.4,32.06) v1(69,86.31) v1(69,58.71) v1(69,31.11) v1(69.6,87.26) v1(69.6,59.66) v1(69.6,32.06) v1(70.2,86.31) v1(70.2,58.71) v1(70.2,31.11) v1(70.8,87.26) v1(70.8,59.66) v1(70.8,32.06) v1(72,69.68) v1(72,42.08) v1(72,14.48) v1(72.21,77.56) v1(72.21,76.36) v1(72.21,75.16) v1(72.21,49.96) v1(72.21,48.76) v1(72.21,47.56) v1(72.21,22.36) v1(72.21,21.16) v1(72.21,19.96) v1(73.17,78.16) v1(73.17,76.96) v1(73.17,75.76) v1(73.17,74.56) v1(73.17,50.56) v1(73.17,49.36) v1(73.17,48.16) v1(73.17,46.96) v1(73.17,22.96) v1(73.17,21.75) v1(73.17,20.56) v1(73.17,19.36) v1(74.8,84.78) v1(74.8,57.18) v1(74.8,29.58) v1(76.4,78.58) v1(76.4,50.98) v1(76.4,23.38) v1(77.3,71.48) v1(77.3,43.88) v1(77.3,16.28)
VDD.A: length 639.2
  Top Layer w0.2: U1#8.4 70.14,26.12 arc(70.21,26.06) 70.29,26.01 arc(70.4,25.98) 70.5,25.97 arc(70.69,26) 70.85,26.11 71.04,26.3 arc(71.18,26.39) 71.35,26.43 71.67,26.43 arc(72,26.36) 72.28,26.18 C1#9.1 73.06,25.39 arc(73.37,25.19) v1(73.73,25.11) ; v1(46.36,66.01) 46.36,66.89 arc(46.25,67.46) 45.93,67.94 45.9,67.96 ; U1#9.4 14.94,81.32 arc(15.01,81.26) 15.09,81.21 arc(15.2,81.18) 15.3,81.17 arc(15.49,81.2) 15.65,81.31 15.84,81.5 arc(15.98,81.59) 16.15,81.63 16.47,81.63 arc(16.8,81.56) 17.08,81.38 C1.1 17.86,80.59 arc(18.17,80.39) v1(18.53,80.31) ; 45.9,40.36 45.93,40.34 arc(46.25,39.86) 46.36,39.29 v1(46.36,38.41) ; v1(73.96,38.41) 73.96,39.29 arc(73.85,39.86) 73.53,40.34 73.51,40.36 ; U1#5.4 70.14,53.72 arc(70.21,53.66) 70.29,53.61 arc(70.4,53.58) 70.5,53.57 arc(70.69,53.6) 70.85,53.71 71.04,53.9 arc(71.18,53.99) 71.35,54.03 71.67,54.03 arc(72,53.96) 72.28,53.78 C1#6.1 73.06,52.99 arc(73.37,52.79) v1(73.73,52.71) ; U1#6.4 14.94,26.12 arc(15.01,26.06) 15.09,26.01 arc(15.2,25.98) 15.3,25.97 arc(15.49,26) 15.65,26.11 15.84,26.3 arc(15.98,26.39) 16.15,26.43 16.47,26.43 arc(16.8,26.36) 17.08,26.18 C1#7.1 17.86,25.39 arc(18.17,25.19) v1(18.53,25.11) ; v1(46.36,10.81) 46.36,11.69 arc(46.25,12.26) 45.93,12.74 45.9,12.76 ; v1(18.76,38.41) 18.76,39.29 arc(18.65,39.86) 18.33,40.34 18.3,40.36 ; v1(73.96,10.81) 73.96,11.69 arc(73.85,12.26) 73.53,12.74 73.51,12.76 ; 18.3,12.76 18.33,12.74 arc(18.65,12.26) 18.76,11.69 v1(18.76,10.81) ; U1#7.4 42.54,26.12 arc(42.61,26.06) 42.69,26.01 arc(42.8,25.98) 42.9,25.97 arc(43.09,26) 43.25,26.11 43.44,26.3 arc(43.58,26.39) 43.75,26.43 44.08,26.43 arc(44.4,26.36) 44.68,26.18 C1#8.1 45.46,25.39 arc(45.77,25.19) v1(46.13,25.11) ; 73.51,67.96 73.53,67.94 arc(73.85,67.46) 73.96,66.89 v1(73.96,66.01) ; 18.3,67.96 18.33,67.94 arc(18.65,67.46) 18.76,66.89 v1(18.76,66.01) ; U1.4 42.54,81.32 arc(42.61,81.26) 42.69,81.21 arc(42.8,81.18) 42.9,81.17 arc(43.09,81.2) 43.25,81.31 43.44,81.5 arc(43.58,81.59) 43.75,81.63 44.08,81.63 arc(44.4,81.56) 44.68,81.38 C1#2.1 45.46,80.59 arc(45.77,80.39) v1(46.13,80.31) ; U1#4.4 42.54,53.72 arc(42.61,53.66) 42.69,53.61 arc(42.8,53.58) 42.9,53.57 arc(43.09,53.6) 43.25,53.71 43.44,53.9 arc(43.58,53.99) 43.75,54.03 44.08,54.03 arc(44.4,53.96) 44.68,53.78 C1#5.1 45.46,52.99 arc(45.77,52.79) v1(46.13,52.71) ; U1#3.4 14.94,53.72 arc(15.01,53.66) 15.09,53.61 arc(15.2,53.58) 15.3,53.57 arc(15.49,53.6) 15.65,53.71 15.84,53.9 arc(15.98,53.99) 16.15,54.03 16.47,54.03 arc(16.8,53.96) 17.08,53.78 C1#4.1 17.86,52.99 arc(18.17,52.79) v1(18.53,52.71) ; U1#2.4 70.14,81.32 arc(70.21,81.26) 70.29,81.21 arc(70.4,81.18) 70.5,81.17 arc(70.69,81.2) 70.85,81.31 71.04,81.5 arc(71.18,81.59) 71.35,81.63 71.67,81.63 arc(72,81.56) 72.28,81.38 C1#3.1 73.06,80.59 arc(73.37,80.39) v1(73.73,80.31)
  Bottom Layer w0.2: U7#9.1 arc(1.96,76.48) 1.8,77.29 1.8,82.14 arc(1.96,82.92) 2.4,83.58 ; U7.1 arc(29.56,76.48) 29.4,77.29 29.4,82.14 arc(29.56,82.92) 30,83.58 ; U7#6.1 arc(1.96,21.28) 1.8,22.09 1.8,26.94 arc(1.96,27.72) 2.4,28.38 ; U7#7.1 arc(29.56,21.28) 29.4,22.09 29.4,26.94 arc(29.56,27.72) 30,28.38 ; 2.4,55.98 arc(1.96,55.32) 1.8,54.54 1.8,49.69 arc(1.96,48.88) U7#3.1 ; U7#4.1 arc(29.56,48.88) 29.4,49.69 29.4,54.54 arc(29.56,55.32) 30,55.98 ; 57.6,28.38 arc(57.16,27.72) 57,26.94 57,22.09 arc(57.16,21.28) U7#8.1 ; 57.6,55.98 arc(57.16,55.32) 57,54.54 57,49.69 arc(57.16,48.88) U7#5.1 ; 57.6,83.58 arc(57.16,82.92) 57,82.14 57,77.29 arc(57.16,76.48) U7#2.1
  Bottom Layer w0.4: C2#8.1 48.22,25.86 arc(47.4,25.31) 46.43,25.11 v1(46.13,25.11) ; v1(18.53,25.11) 18.83,25.11 arc(19.8,25.31) 20.62,25.86 C2#7.1 ; v1(73.73,25.11) 74.03,25.11 arc(75,25.31) 75.82,25.86 C2#9.1 ; v1(46.13,52.71) 46.43,52.71 arc(47.4,52.91) 48.22,53.46 C2#5.1 ; v1(73.73,52.71) 74.03,52.71 arc(75,52.91) 75.82,53.46 C2#6.1 ; C2.1 20.62,81.06 arc(19.8,80.51) 18.83,80.31 v1(18.53,80.31) ; v1(46.13,80.31) 46.43,80.31 arc(47.4,80.51) 48.22,81.06 C2#2.1 ; v1(18.53,52.71) 18.83,52.71 arc(19.8,52.91) 20.62,53.46 C2#4.1 ; v1(73.73,80.31) 74.03,80.31 arc(75,80.51) 75.82,81.06 C2#3.1
  Bottom Layer w0.7: U7#9.1 2.42,67.28 arc(3.17,65.49) 4.97,64.74 21.99,64.74 arc(23.54,65.38) 24.17,66.92 U7#9.1 24.17,81.76 arc(23.98,82.74) 23.43,83.56 C2.1 ; U7#5.1 57.62,39.68 arc(58.37,37.89) 60.17,37.14 77.2,37.14 arc(78.74,37.78) 79.37,39.32 U7#5.1 79.37,54.16 arc(79.18,55.14) 78.63,55.96 C2#6.1 ; U7#6.1 2.42,12.08 arc(3.17,10.29) 4.97,9.54 21.99,9.54 arc(23.54,10.18) 24.17,11.72 U7#6.1 24.17,26.56 arc(23.98,27.54) 23.43,28.36 C2#7.1 ; C2#2.1 51.03,83.56 arc(51.58,82.74) 51.77,81.76 U7.1 51.77,66.92 arc(51.14,65.38) 49.59,64.74 32.56,64.74 arc(30.77,65.49) 30.02,67.28 U7.1 ; C2#3.1 78.63,83.56 arc(79.18,82.74) 79.37,81.76 U7#2.1 79.37,66.92 arc(78.74,65.38) 77.2,64.74 60.17,64.74 arc(58.37,65.49) 57.62,67.28 U7#2.1 ; U7#4.1 30.02,39.68 arc(30.77,37.89) 32.56,37.14 49.59,37.14 arc(51.14,37.78) 51.77,39.32 U7#4.1 51.77,54.16 arc(51.58,55.14) 51.03,55.96 C2#5.1 ; U7#8.1 57.62,12.08 arc(58.37,10.29) 60.17,9.54 77.2,9.54 arc(78.74,10.18) 79.37,11.72 U7#8.1 79.37,26.56 arc(79.18,27.54) 78.63,28.36 C2#9.1 ; U7#3.1 2.42,39.68 arc(3.17,37.89) 4.97,37.14 21.99,37.14 arc(23.54,37.78) 24.17,39.32 U7#3.1 24.17,54.16 arc(23.98,55.14) 23.43,55.96 C2#4.1 ; U7#7.1 30.02,12.08 arc(30.77,10.29) 32.56,9.54 49.59,9.54 arc(51.14,10.18) 51.77,11.72 U7#7.1 51.77,26.56 arc(51.58,27.54) 51.03,28.36 C2#8.1
BUTTON.A: length 512.6
  Top Layer w0.2: 38.06,38.96 37.76,39.26 arc(37.45,39.72) 37.34,40.26 37.34,41.03 arc(37.27,41.42) 37.05,41.75 C3#4.1 ; 38.06,38.96 35.72,36.61 arc(34.89,36.06) 33.92,35.87 31.88,35.87 arc(29.64,36.8) 28.71,39.04 28.71,57.33 arc(29.64,59.57) 31.88,60.5 34.72,60.5 arc(35.67,60.31) 36.48,59.78 U1#4.12 ; 38.06,38.96 SW1#5.3 SW1#5.4 44.15,38.96 arc(44.47,39.02) 44.75,39.2 R8#4.2 ; C3#2.1 64.65,69.35 arc(64.87,69.02) 64.94,68.63 64.94,67.86 arc(65.05,67.32) 65.36,66.86 65.66,66.56 ; 65.66,11.36 SW1.3 SW1.4 71.75,11.36 arc(72.07,11.42) 72.35,11.6 R8#8.2 ; 65.66,11.36 65.36,11.66 arc(65.05,12.12) 64.94,12.66 64.94,13.43 arc(64.87,13.82) 64.65,14.15 C3#7.1 ; 65.66,11.36 63.32,9.01 arc(62.49,8.46) 61.52,8.27 59.48,8.27 arc(57.24,9.2) 56.31,11.44 56.31,29.73 arc(57.24,31.97) 59.48,32.9 62.32,32.9 arc(63.27,32.71) 64.08,32.18 U1#8.12 ; U1#5.12 64.08,59.78 arc(63.27,60.31) 62.32,60.5 59.48,60.5 arc(57.24,59.57) 56.31,57.33 56.31,39.04 arc(57.24,36.8) 59.48,35.87 61.52,35.87 arc(62.49,36.06) 63.32,36.61 65.66,38.96 ; 10.46,11.36 10.16,11.66 arc(9.85,12.12) 9.74,12.66 9.74,13.43 arc(9.67,13.82) 9.45,14.15 C3#6.1 ; 10.46,11.36 SW1#7.3 SW1#7.4 16.55,11.36 arc(16.87,11.42) 17.15,11.6 R8#6.2 ; 10.46,11.36 8.12,9.01 arc(7.29,8.46) 6.32,8.27 4.28,8.27 arc(2.04,9.2) 1.11,11.44 1.11,29.73 arc(2.04,31.97) 4.28,32.9 7.12,32.9 arc(8.07,32.71) 8.88,32.18 U1#6.12 ; 38.06,11.36 SW1#8.3 SW1#8.4 44.15,11.36 arc(44.47,11.42) 44.75,11.6 R8#7.2 ; 38.06,11.36 37.76,11.66 arc(37.45,12.12) 37.34,12.66 37.34,13.43 arc(37.27,13.82) 37.05,14.15 36.57,14.63 ; 38.06,11.36 35.72,9.01 arc(34.89,8.46) 33.92,8.27 31.88,8.27 arc(29.64,9.2) 28.71,11.44 28.71,29.73 arc(29.64,31.97) 31.88,32.9 34.72,32.9 arc(35.67,32.71) 36.48,32.18 U1#7.12 ; 65.66,38.96 SW1#6.3 SW1#6.4 71.75,38.96 arc(72.07,39.02) 72.35,39.2 R8#5.2 ; 65.66,38.96 65.36,39.26 arc(65.05,39.72) 64.94,40.26 64.94,41.03 arc(64.87,41.42) 64.65,41.75 C3#5.1 ; 38.06,66.56 35.72,64.21 arc(34.89,63.66) 33.92,63.47 31.88,63.47 arc(29.64,64.4) 28.71,66.64 28.71,84.93 arc(29.64,87.17) 31.88,88.1 34.72,88.1 arc(35.67,87.91) 36.48,87.38 U1.12 ; 38.06,66.56 37.76,66.86 arc(37.45,67.32) 37.34,67.86 37.34,68.63 arc(37.27,69.02) 37.05,69.35 C3.1 ; 38.06,66.56 SW1#2.3 SW1#2.4 44.15,66.56 arc(44.47,66.62) 44.75,66.8 R8.2 ; 10.46,66.56 8.12,64.21 arc(7.29,63.66) 6.32,63.47 4.28,63.47 arc(2.04,64.4) 1.11,66.64 1.11,84.93 arc(2.04,87.17) 4.28,88.1 7.12,88.1 arc(8.07,87.91) 8.88,87.38 U1#9.12 ; 10.46,66.56 SW1#9.3 SW1#9.4 16.55,66.56 arc(16.87,66.62) 17.15,66.8 R8#9.2 ; 10.46,66.56 10.16,66.86 arc(9.85,67.32) 9.74,67.86 9.74,68.63 arc(9.67,69.02) 9.45,69.35 C3#8.1 ; U1#3.12 8.88,59.78 arc(8.07,60.31) 7.12,60.5 4.28,60.5 arc(2.04,59.57) 1.11,57.33 1.11,39.04 arc(2.04,36.8) 4.28,35.87 6.32,35.87 arc(7.29,36.06) 8.12,36.61 10.46,38.96 ; 10.46,38.96 10.16,39.26 arc(9.85,39.72) 9.74,40.26 9.74,41.03 arc(9.67,41.42) 9.45,41.75 C3#3.1 ; 10.46,38.96 SW1#4.3 SW1#4.4 16.55,38.96 arc(16.87,39.02) 17.15,39.2 R8#3.2 ; R8#2.2 72.35,66.8 arc(72.07,66.62) 71.75,66.56 SW1#3.4 SW1#3.3 65.66,66.56 ; 65.66,66.56 63.32,64.21 arc(62.49,63.66) 61.52,63.47 59.48,63.47 arc(57.24,64.4) 56.31,66.64 56.31,84.93 arc(57.24,87.17) 59.48,88.1 62.32,88.1 arc(63.27,87.91) 64.08,87.38 U1#2.12
LED1: length 134
  Top Layer w0.2: R1#7.2 20.28,15.77 arc(19.88,16.04) 19.4,16.14 18.71,16.14 arc(17.94,16.29) 17.28,16.73 15.95,18.06 arc(15.4,18.89) 15.2,19.86 15.2,23.76 arc(15.03,24.64) 14.53,25.4 U1#6.2 ; R1#8.2 47.88,15.77 arc(47.48,16.04) 47,16.14 46.31,16.14 arc(45.54,16.29) 44.88,16.73 43.55,18.06 arc(43,18.89) 42.8,19.86 42.8,23.76 arc(42.63,24.64) 42.13,25.4 U1#7.2 ; R1#9.2 75.48,15.77 arc(75.08,16.04) 74.6,16.14 73.91,16.14 arc(73.14,16.29) 72.48,16.73 71.15,18.06 arc(70.6,18.89) 70.4,19.86 70.4,23.76 arc(70.23,24.64) 69.73,25.4 U1#8.2 ; R1#3.2 75.48,70.97 arc(75.08,71.24) 74.6,71.34 73.91,71.34 arc(73.14,71.49) 72.48,71.93 71.15,73.26 arc(70.6,74.09) 70.4,75.06 70.4,78.96 arc(70.23,79.84) 69.73,80.6 U1#2.2 ; U1.2 42.13,80.6 arc(42.63,79.84) 42.8,78.96 42.8,75.06 arc(43,74.09) 43.55,73.26 44.88,71.93 arc(45.54,71.49) 46.31,71.34 47,71.34 arc(47.48,71.24) 47.88,70.97 R1#2.2 ; R1#6.2 75.48,43.37 arc(75.08,43.64) 74.6,43.74 73.91,43.74 arc(73.14,43.89) 72.48,44.33 71.15,45.66 arc(70.6,46.49) 70.4,47.46 70.4,51.36 arc(70.23,52.24) 69.73,53 U1#5.2 ; U1#9.2 14.53,80.6 arc(15.03,79.84) 15.2,78.96 15.2,75.06 arc(15.4,74.09) 15.95,73.26 17.28,71.93 arc(17.94,71.49) 18.71,71.34 19.4,71.34 arc(19.88,71.24) 20.28,70.97 R1.2 ; R1#4.2 20.28,43.37 arc(19.88,43.64) 19.4,43.74 18.71,43.74 arc(17.94,43.89) 17.28,44.33 15.95,45.66 arc(15.4,46.49) 15.2,47.46 15.2,51.36 arc(15.03,52.24) 14.53,53 U1#3.2 ; R1#5.2 47.88,43.37 arc(47.48,43.64) 47,43.74 46.31,43.74 arc(45.54,43.89) 44.88,44.33 43.55,45.66 arc(43,46.49) 42.8,47.46 42.8,51.36 arc(42.63,52.24) 42.13,53 U1#4.2
LED2: length 124.1
  Top Layer w0.2: 20.99,45.21 20.02,46.19 arc(19.6,46.81) 19.46,47.54 19.46,52.56 arc(19.34,53.15) 19,53.66 18.49,54.18 arc(17.81,54.63) 17,54.79 15.6,54.79 arc(15.31,54.73) 15.07,54.57 U1#3.5 ; 76.2,17.61 75.22,18.59 arc(74.8,19.21) 74.66,19.94 74.66,24.96 arc(74.54,25.55) 74.2,26.06 73.69,26.58 arc(73.01,27.03) 72.2,27.19 70.8,27.19 arc(70.51,27.13) 70.27,26.97 U1#8.5 ; 76.2,72.81 75.22,73.79 arc(74.8,74.41) 74.66,75.14 74.66,80.16 arc(74.54,80.75) 74.2,81.26 73.69,81.78 arc(73.01,82.23) 72.2,82.39 70.8,82.39 arc(70.51,82.33) 70.27,82.17 U1#2.5 ; U1#5.5 70.27,54.57 arc(70.51,54.73) 70.8,54.79 72.2,54.79 arc(73.01,54.63) 73.69,54.18 74.2,53.66 arc(74.54,53.15) 74.66,52.56 74.66,47.54 arc(74.8,46.81) 75.22,46.19 76.2,45.21 ; U1#6.5 15.07,26.97 arc(15.31,27.13) 15.6,27.19 17,27.19 arc(17.81,27.03) 18.49,26.58 19,26.06 arc(19.34,25.55) 19.46,24.96 19.46,19.94 arc(19.6,19.21) 20.02,18.59 20.99,17.61 ; U1#7.5 42.67,26.97 arc(42.91,27.13) 43.2,27.19 44.6,27.19 arc(45.41,27.03) 46.09,26.58 46.6,26.06 arc(46.94,25.55) 47.06,24.96 47.06,19.94 arc(47.2,19.21) 47.62,18.59 48.59,17.61 ; 20.99,72.81 20.02,73.79 arc(19.6,74.41) 19.46,75.14 19.46,80.16 arc(19.34,80.75) 19,81.26 18.49,81.78 arc(17.81,82.23) 17,82.39 15.6,82.39 arc(15.31,82.33) 15.07,82.17 U1#9.5 ; U1#4.5 42.67,54.57 arc(42.91,54.73) 43.2,54.79 44.6,54.79 arc(45.41,54.63) 46.09,54.18 46.6,53.66 arc(46.94,53.15) 47.06,52.56 47.06,47.54 arc(47.2,46.81) 47.62,46.19 48.59,45.21 ; U1.5 42.67,82.17 arc(42.91,82.33) 43.2,82.39 44.6,82.39 arc(45.41,82.23) 46.09,81.78 46.6,81.26 arc(46.94,80.75) 47.06,80.16 47.06,75.14 arc(47.2,74.41) 47.62,73.79 48.59,72.81
LED3: length 68
  Top Layer w0.2: U1#7.6 42.94,28.09 arc(43.34,28.36) 43.82,28.46 45.45,28.46 arc(46.08,28.33) 46.61,27.98 R3#8.2 ; R3.2 46.61,83.18 arc(46.08,83.53) 45.45,83.66 43.82,83.66 arc(43.34,83.56) 42.94,83.29 U1.6 ; U1#9.6 15.34,83.29 arc(15.74,83.56) 16.22,83.66 17.85,83.66 arc(18.48,83.53) 19.01,83.18 R3#5.2 ; U1#5.6 70.54,55.69 arc(70.94,55.96) 71.42,56.06 73.05,56.06 arc(73.68,55.93) 74.21,55.58 R3#6.2 ; U1#2.6 70.54,83.29 arc(70.94,83.56) 71.42,83.66 73.05,83.66 arc(73.68,83.53) 74.21,83.18 R3#2.2 ; U1#6.6 15.34,28.09 arc(15.74,28.36) 16.22,28.46 17.85,28.46 arc(18.48,28.33) 19.01,27.98 R3#7.2 ; R3#9.2 74.21,27.98 arc(73.68,28.33) 73.05,28.46 71.42,28.46 arc(70.94,28.36) 70.54,28.09 U1#8.6 ; R3#3.2 19.01,55.58 arc(18.48,55.93) 17.85,56.06 16.22,56.06 arc(15.74,55.96) 15.34,55.69 U1#3.6 ; R3#4.2 46.61,55.58 arc(46.08,55.93) 45.45,56.06 43.82,56.06 arc(43.34,55.96) 42.94,55.69 U1#4.6
LED4: length 57.6
  Top Layer w0.2: U1#2.16 arc(66.9,81.97) 66.87,81.99 66.52,82.34 arc(66.32,82.47) 66.09,82.52 arc(65.85,82.47) 65.65,82.34 65.33,82.01 arc(64.95,81.44) 64.82,80.78 64.82,78.97 arc(64.94,78.37) R4#2.2 ; R4#7.2 arc(37.34,23.17) 37.22,23.77 37.22,25.58 arc(37.35,26.24) 37.73,26.81 38.05,27.14 arc(38.25,27.27) 38.49,27.32 arc(38.72,27.27) 38.92,27.14 39.27,26.79 arc(39.3,26.77) U1#7.16 ; U1#6.16 arc(11.7,26.77) 11.67,26.79 11.32,27.14 arc(11.12,27.27) 10.89,27.32 arc(10.65,27.27) 10.45,27.14 10.12,26.81 arc(9.75,26.24) 9.62,25.58 9.62,23.77 arc(9.74,23.17) R4#6.2 ; U1#9.16 arc(11.7,81.97) 11.67,81.99 11.32,82.34 arc(11.12,82.47) 10.89,82.52 arc(10.65,82.47) 10.45,82.34 10.12,82.01 arc(9.75,81.44) 9.62,80.78 9.62,78.97 arc(9.74,78.37) R4#9.2 ; R4#4.2 arc(37.34,50.77) 37.22,51.37 37.22,53.18 arc(37.35,53.84) 37.73,54.41 38.05,54.74 arc(38.25,54.87) 38.49,54.92 arc(38.72,54.87) 38.92,54.74 39.27,54.39 arc(39.3,54.37) U1#4.16 ; U1#3.16 arc(11.7,54.37) 11.67,54.39 11.32,54.74 arc(11.12,54.87) 10.89,54.92 arc(10.65,54.87) 10.45,54.74 10.12,54.41 arc(9.75,53.84) 9.62,53.18 9.62,51.37 arc(9.74,50.77) R4#3.2 ; U1#8.16 arc(66.9,26.77) 66.87,26.79 66.52,27.14 arc(66.32,27.27) 66.09,27.32 arc(65.85,27.27) 65.65,27.14 65.33,26.81 arc(64.95,26.24) 64.82,25.58 64.82,23.77 arc(64.94,23.17) R4#8.2 ; U1#5.16 arc(66.9,54.37) 66.87,54.39 66.52,54.74 arc(66.32,54.87) 66.09,54.92 arc(65.85,54.87) 65.65,54.74 65.33,54.41 arc(64.95,53.84) 64.82,53.18 64.82,51.37 arc(64.94,50.77) R4#5.2 ; R4.2 arc(37.34,78.37) 37.22,78.97 37.22,80.78 arc(37.35,81.44) 37.73,82.01 38.05,82.34 arc(38.25,82.47) 38.49,82.52 arc(38.72,82.47) 38.92,82.34 39.27,81.99 arc(39.3,81.97) U1.16
LED5: length 58.3
  Top Layer w0.2: U1#6.13 11.69,28.8 arc(11.22,29.11) 10.68,29.22 10.4,29.22 arc(9.66,29.07) 9.02,28.65 7.13,26.76 ; 62.33,26.76 64.22,28.65 arc(64.86,29.07) 65.6,29.22 65.88,29.22 arc(66.42,29.11) 66.89,28.8 U1#8.13 ; 34.73,26.76 36.62,28.65 arc(37.26,29.07) 38,29.22 38.28,29.22 arc(38.82,29.11) 39.29,28.8 U1#7.13 ; 62.33,81.96 64.22,83.85 arc(64.86,84.27) 65.6,84.42 65.88,84.42 arc(66.42,84.31) 66.89,84 U1#2.13 ; 7.13,81.96 9.02,83.85 arc(9.66,84.27) 10.4,84.42 10.68,84.42 arc(11.22,84.31) 11.69,84 U1#9.13 ; U1.13 39.29,84 arc(38.82,84.31) 38.28,84.42 38,84.42 arc(37.26,84.27) 36.62,83.85 34.73,81.96 ; 7.13,54.36 9.02,56.25 arc(9.66,56.67) 10.4,56.82 10.68,56.82 arc(11.22,56.71) 11.69,56.4 U1#3.13 ; U1#4.13 39.29,56.4 arc(38.82,56.71) 38.28,56.82 38,56.82 arc(37.26,56.67) 36.62,56.25 34.73,54.36 ; 62.33,54.36 64.22,56.25 arc(64.86,56.67) 65.6,56.82 65.88,56.82 arc(66.42,56.71) 66.89,56.4 U1#5.13
LED6: length 76.5
  Top Layer w0.2: U1#2.14 66.68,83.64 arc(66.38,83.84) 66.03,83.91 65.72,83.91 arc(65.36,83.84) 65.05,83.63 64.11,82.7 arc(63.69,82.07) 63.55,81.33 63.55,80.86 arc(63.43,80.28) 63.1,79.78 62.08,78.76 ; 34.48,51.16 35.5,52.18 arc(35.83,52.68) 35.95,53.26 35.95,53.73 arc(36.09,54.47) 36.51,55.1 37.45,56.03 arc(37.76,56.24) 38.12,56.31 38.43,56.31 arc(38.78,56.24) 39.08,56.04 U1#4.14 ; 6.88,51.16 7.9,52.18 arc(8.23,52.68) 8.35,53.26 8.35,53.73 arc(8.49,54.47) 8.91,55.1 9.85,56.03 arc(10.16,56.24) 10.52,56.31 10.83,56.31 arc(11.18,56.24) 11.48,56.04 U1#3.14 ; U1#9.14 11.48,83.64 arc(11.18,83.84) 10.83,83.91 10.52,83.91 arc(10.16,83.84) 9.85,83.63 8.91,82.7 arc(8.49,82.07) 8.35,81.33 8.35,80.86 arc(8.23,80.28) 7.9,79.78 6.88,78.76 ; U1#6.14 11.48,28.44 arc(11.18,28.64) 10.83,28.71 10.52,28.71 arc(10.16,28.64) 9.85,28.43 8.91,27.5 arc(8.49,26.87) 8.35,26.13 8.35,25.66 arc(8.23,25.08) 7.9,24.58 6.88,23.56 ; 34.48,23.56 35.5,24.58 arc(35.83,25.08) 35.95,25.66 35.95,26.13 arc(36.09,26.87) 36.51,27.5 37.45,28.43 arc(37.76,28.64) 38.12,28.71 38.43,28.71 arc(38.78,28.64) 39.08,28.44 U1#7.14 ; U1#5.14 66.68,56.04 arc(66.38,56.24) 66.03,56.31 65.72,56.31 arc(65.36,56.24) 65.05,56.03 64.11,55.1 arc(63.69,54.47) 63.55,53.73 63.55,53.26 arc(63.43,52.68) 63.1,52.18 62.08,51.16 ; 62.08,23.56 63.1,24.58 arc(63.43,25.08) 63.55,25.66 63.55,26.13 arc(63.69,26.87) 64.11,27.5 65.05,28.43 arc(65.36,28.64) 65.72,28.71 66.03,28.71 arc(66.38,28.64) 66.68,28.44 U1#8.14 ; 34.48,78.76 35.5,79.78 arc(35.83,80.28) 35.95,80.86 35.95,81.33 arc(36.09,82.07) 36.51,82.7 37.45,83.63 arc(37.76,83.84) 38.12,83.91 38.43,83.91 arc(38.78,83.84) 39.08,83.64 U1.14
LED7: length 175.5
  Top Layer w0.2: R7#7.2 31.84,15.91 arc(31.49,16.42) 31.37,17.02 31.37,17.92 arc(31.6,18.46) 32.14,18.68 34.69,18.68 arc(36.03,19.23) 36.58,20.57 36.58,26.03 arc(36.7,26.63) 37.04,27.14 37.86,27.95 arc(38.13,28.14) 38.46,28.2 arc(38.73,28.15) 38.96,28 U1#7.15 ; R7.2 31.84,71.11 arc(31.49,71.62) 31.37,72.22 31.37,73.12 arc(31.6,73.66) 32.14,73.88 34.69,73.88 arc(36.03,74.43) 36.58,75.77 36.58,81.23 arc(36.7,81.83) 37.04,82.34 37.86,83.15 arc(38.13,83.34) 38.46,83.4 arc(38.73,83.35) 38.96,83.2 U1.15 ; U1#3.15 11.36,55.6 arc(11.13,55.75) 10.86,55.8 arc(10.53,55.74) 10.25,55.55 9.44,54.74 arc(9.1,54.23) 8.98,53.63 8.98,48.17 arc(8.43,46.83) 7.09,46.28 4.54,46.28 arc(4,46.06) 3.77,45.52 3.77,44.62 arc(3.89,44.02) 4.24,43.51 R7#3.2 ; R7#5.2 59.44,43.51 arc(59.09,44.02) 58.98,44.62 58.98,45.52 arc(59.2,46.06) 59.74,46.28 62.29,46.28 arc(63.63,46.83) 64.18,48.17 64.18,53.63 arc(64.3,54.23) 64.64,54.74 65.45,55.55 arc(65.73,55.74) 66.06,55.8 arc(66.33,55.75) 66.56,55.6 U1#5.15 ; U1#9.15 11.36,83.2 arc(11.13,83.35) 10.86,83.4 arc(10.53,83.34) 10.25,83.15 9.44,82.34 arc(9.1,81.83) 8.98,81.23 8.98,75.77 arc(8.43,74.43) 7.09,73.88 4.54,73.88 arc(4,73.66) 3.77,73.12 3.77,72.22 arc(3.89,71.62) 4.24,71.11 R7#9.2 ; U1#6.15 11.36,28 arc(11.13,28.15) 10.86,28.2 arc(10.53,28.14) 10.25,27.95 9.44,27.14 arc(9.1,26.63) 8.98,26.03 8.98,20.57 arc(8.43,19.23) 7.09,18.68 4.54,18.68 arc(4,18.46) 3.77,17.92 3.77,17.02 arc(3.89,16.42) 4.24,15.91 R7#6.2 ; U1#8.15 66.56,28 arc(66.33,28.15) 66.06,28.2 arc(65.73,28.14) 65.45,27.95 64.64,27.14 arc(64.3,26.63) 64.18,26.03 64.18,20.57 arc(63.63,19.23) 62.29,18.68 59.74,18.68 arc(59.2,18.46) 58.98,17.92 58.98,17.02 arc(59.09,16.42) 59.44,15.91 R7#8.2 ; U1#4.15 38.96,55.6 arc(38.73,55.75) 38.46,55.8 arc(38.13,55.74) 37.86,55.55 37.04,54.74 arc(36.7,54.23) 36.58,53.63 36.58,48.17 arc(36.03,46.83) 34.69,46.28 32.14,46.28 arc(31.6,46.06) 31.37,45.52 31.37,44.62 arc(31.49,44.02) 31.84,43.51 R7#4.2 ; U1#2.15 66.56,83.2 arc(66.33,83.35) 66.06,83.4 arc(65.73,83.34) 65.45,83.15 64.64,82.34 arc(64.3,81.83) 64.18,81.23 64.18,75.77 arc(63.63,74.43) 62.29,73.88 59.74,73.88 arc(59.2,73.66) 58.98,73.12 58.98,72.22 arc(59.09,71.62) 59.44,71.11 R7#2.2
UPDI.A: length 97.1
  Top Layer w0.2: U1#3.19 12.09,53.01 arc(11.95,52.92) 11.78,52.88 arc(11.54,52.93) 11.34,53.06 v1(10.89,53.52) ; v1(38.49,53.52) 38.94,53.06 arc(39.14,52.93) 39.38,52.88 arc(39.55,52.92) 39.69,53.01 U1#4.19 ; U1#8.19 67.29,25.41 arc(67.15,25.32) 66.98,25.28 arc(66.74,25.33) 66.54,25.46 v1(66.09,25.92) ; v1(66.09,53.52) 66.54,53.06 arc(66.74,52.93) 66.98,52.88 arc(67.15,52.92) 67.29,53.01 U1#5.19 ; U1#2.19 67.29,80.61 arc(67.15,80.52) 66.98,80.48 arc(66.74,80.53) 66.54,80.66 v1(66.09,81.12) ; U1#9.19 12.09,80.61 arc(11.95,80.52) 11.78,80.48 arc(11.54,80.53) 11.34,80.66 v1(10.89,81.12) ; v1(38.49,25.92) 38.94,25.46 arc(39.14,25.33) 39.38,25.28 arc(39.55,25.32) 39.69,25.41 U1#7.19 ; U1.19 39.69,80.61 arc(39.55,80.52) 39.38,80.48 arc(39.14,80.53) 38.94,80.66 v1(38.49,81.12) ; v1(10.89,25.92) 11.34,25.46 arc(11.54,25.33) 11.78,25.28 arc(11.95,25.32) 12.09,25.41 U1#6.19
  Bottom Layer w0.2: NOREF#9.1 4.7,84.99 arc(4.83,84.34) 5.2,83.78 5.26,83.73 arc(6.08,83.18) 7.05,82.98 7.97,82.98 arc(8.94,82.79) 9.77,82.24 v1(10.89,81.12) ; v1(10.89,25.92) 9.77,27.04 arc(8.94,27.59) 7.97,27.78 7.05,27.78 arc(6.08,27.98) 5.26,28.53 5.2,28.58 arc(4.83,29.14) 4.7,29.79 NOREF#5.38 ; v1(38.49,25.92) 37.36,27.04 arc(36.54,27.59) 35.57,27.78 34.65,27.78 arc(33.68,27.98) 32.86,28.53 32.8,28.58 arc(32.43,29.14) 32.3,29.79 NOREF#25.41 ; v1(38.49,81.12) 37.36,82.24 arc(36.54,82.79) 35.57,82.98 34.65,82.98 arc(33.68,83.18) 32.86,83.73 32.8,83.78 arc(32.43,84.34) 32.3,84.99 NOREF#3.23 ; v1(10.89,53.52) 9.77,54.64 arc(8.94,55.19) 7.97,55.38 7.05,55.38 arc(6.08,55.58) 5.26,56.13 5.2,56.18 arc(4.83,56.74) 4.7,57.39 NOREF#13.29 ; NOREF#19.44 59.9,29.79 arc(60.03,29.14) 60.4,28.58 60.46,28.53 arc(61.28,27.98) 62.25,27.78 63.17,27.78 arc(64.14,27.59) 64.96,27.04 v1(66.09,25.92) ; v1(66.09,53.52) 64.96,54.64 arc(64.14,55.19) 63.17,55.38 62.25,55.38 arc(61.28,55.58) 60.46,56.13 60.4,56.18 arc(60.03,56.74) 59.9,57.39 NOREF#20.35 ; NOREF#2.26 59.9,84.99 arc(60.03,84.34) 60.4,83.78 60.46,83.73 arc(61.28,83.18) 62.25,82.98 63.17,82.98 arc(64.14,82.79) 64.96,82.24 v1(66.09,81.12) ; v1(38.49,53.52) 37.36,54.64 arc(36.54,55.19) 35.57,55.38 34.65,55.38 arc(33.68,55.58) 32.86,56.13 32.8,56.18 arc(32.43,56.74) 32.3,57.39 NOREF#8.32
$1N725: length 23.2
  Top Layer w0.2: R1#8.1 49.91,13.75 arc(50.24,13.26) 50.35,12.68 LED7#10.1 ; LED7#11.1 50.35,40.28 arc(50.24,40.86) 49.91,41.35 R1#5.1 ; R1#4.1 22.31,41.35 arc(22.64,40.86) 22.75,40.28 LED7#14.1 ; R1#2.1 49.91,68.95 arc(50.24,68.46) 50.35,67.88 LED7#12.1 ; R1#3.1 77.51,68.95 arc(77.84,68.46) 77.95,67.88 LED1.1 ; R1#9.1 77.51,13.75 arc(77.84,13.26) 77.95,12.68 LED1#3.1 ; LED7#15.1 22.75,12.68 arc(22.64,13.26) 22.31,13.75 R1#7.1 ; LED1#2.1 77.95,40.28 arc(77.84,40.86) 77.51,41.35 R1#6.1 ; R1.1 22.31,68.95 arc(22.64,68.46) 22.75,67.88 LED7#13.1
$1N793: length 25
  Top Layer w0.2: R2#9.1 77.58,19 arc(77.85,19.41) 77.95,19.89 LED2#3.1 ; R2#5.1 49.98,46.6 arc(50.25,47.01) 50.35,47.49 LED2#8.1 ; 21.61,73.42 22.38,74.2 arc(22.65,74.61) 22.75,75.09 LED2#4.1 ; R2#6.1 77.58,46.6 arc(77.85,47.01) 77.95,47.49 LED2#2.1 ; LED2#6.1 22.75,19.89 arc(22.65,19.41) 22.38,19 21.61,18.22 ; LED2#7.1 50.35,19.89 arc(50.25,19.41) 49.98,19 R2#8.1 ; 21.61,45.82 22.38,46.6 arc(22.65,47.01) 22.75,47.49 LED2#5.1 ; R2.1 49.98,74.2 arc(50.25,74.61) 50.35,75.09 LED2#9.1 ; LED2.1 77.95,75.09 arc(77.85,74.61) 77.58,74.2 R2#3.1
$1N861: length 27.6
  Top Layer w0.2: LED3#8.1 50.35,55.68 arc(50.24,55.14) 49.94,54.68 R3#4.1 ; LED3#2.1 77.95,55.68 arc(77.84,55.14) 77.54,54.68 R3#6.1 ; LED3#6.1 22.75,28.08 arc(22.64,27.54) 22.34,27.08 R3#7.1 ; LED3.1 77.95,83.28 arc(77.84,82.74) 77.54,82.28 R3#2.1 ; R3#8.1 49.94,27.08 arc(50.24,27.54) 50.35,28.08 LED3#7.1 ; R3.1 49.94,82.28 arc(50.24,82.74) 50.35,83.28 LED3#9.1 ; R3#9.1 77.54,27.08 arc(77.84,27.54) 77.95,28.08 LED3#3.1 ; LED3#5.1 22.75,55.68 arc(22.64,55.14) 22.34,54.68 R3#3.1 ; R3#5.1 22.34,82.28 arc(22.64,82.74) 22.75,83.28 LED3#4.1
$1N929: length 40.3
  Top Layer w0.2: 10.69,49.66 10.78,49.56 arc(11.18,49.29) 11.65,49.2 13.73,49.2 arc(14.05,49.07) 14.19,48.74 14.19,48.22 LED4#5.1 ; 10.69,77.26 10.78,77.16 arc(11.18,76.89) 11.65,76.8 13.73,76.8 arc(14.05,76.67) 14.19,76.34 14.19,75.82 LED4#4.1 ; LED4#3.1 69.39,20.62 69.39,21.14 arc(69.25,21.47) 68.93,21.6 66.85,21.6 arc(66.38,21.69) 65.98,21.96 65.89,22.06 ; 65.89,77.26 65.98,77.16 arc(66.38,76.89) 66.85,76.8 68.93,76.8 arc(69.25,76.67) 69.39,76.34 69.39,75.82 LED4.1 ; LED4#6.1 14.19,20.62 14.19,21.14 arc(14.05,21.47) 13.73,21.6 11.65,21.6 arc(11.18,21.69) 10.78,21.96 10.69,22.06 ; LED4#8.1 41.79,48.22 41.79,48.74 arc(41.65,49.07) 41.33,49.2 39.25,49.2 arc(38.78,49.29) 38.38,49.56 38.29,49.66 ; LED4#7.1 41.79,20.62 41.79,21.14 arc(41.65,21.47) 41.33,21.6 39.25,21.6 arc(38.78,21.69) 38.38,21.96 38.29,22.06 ; 38.29,77.26 38.38,77.16 arc(38.78,76.89) 39.25,76.8 41.33,76.8 arc(41.65,76.67) 41.79,76.34 41.79,75.82 LED7#16.1 ; 65.89,49.66 65.98,49.56 arc(66.38,49.29) 66.85,49.2 68.93,49.2 arc(69.25,49.07) 69.39,48.74 69.39,48.22 LED4#2.1
$1N1129: length 27.2
  Top Layer w0.22: LED7#6.1 5.55,12.93 arc(5.47,13.34) 5.24,13.69 4.36,14.56 ; 4.36,69.76 5.24,68.89 arc(5.47,68.54) 5.55,68.13 LED7#4.1 ; 4.36,42.16 5.24,41.29 arc(5.47,40.94) 5.55,40.53 LED7#5.1 ; 31.96,42.16 32.84,41.29 arc(33.07,40.94) 33.15,40.53 LED7#8.1 ; 59.56,69.76 60.44,68.89 arc(60.67,68.54) 60.75,68.13 LED7.1 ; 59.56,14.56 60.44,13.69 arc(60.67,13.34) 60.75,12.93 LED7#3.1 ; LED7#9.1 33.15,68.13 arc(33.07,68.54) 32.84,68.89 31.96,69.76 ; 31.96,14.56 32.84,13.69 arc(33.07,13.34) 33.15,12.93 LED7#7.1 ; 59.56,42.16 60.44,41.29 arc(60.67,40.94) 60.75,40.53 LED7#2.1
